# Altium project Control Logic.PrjPcb
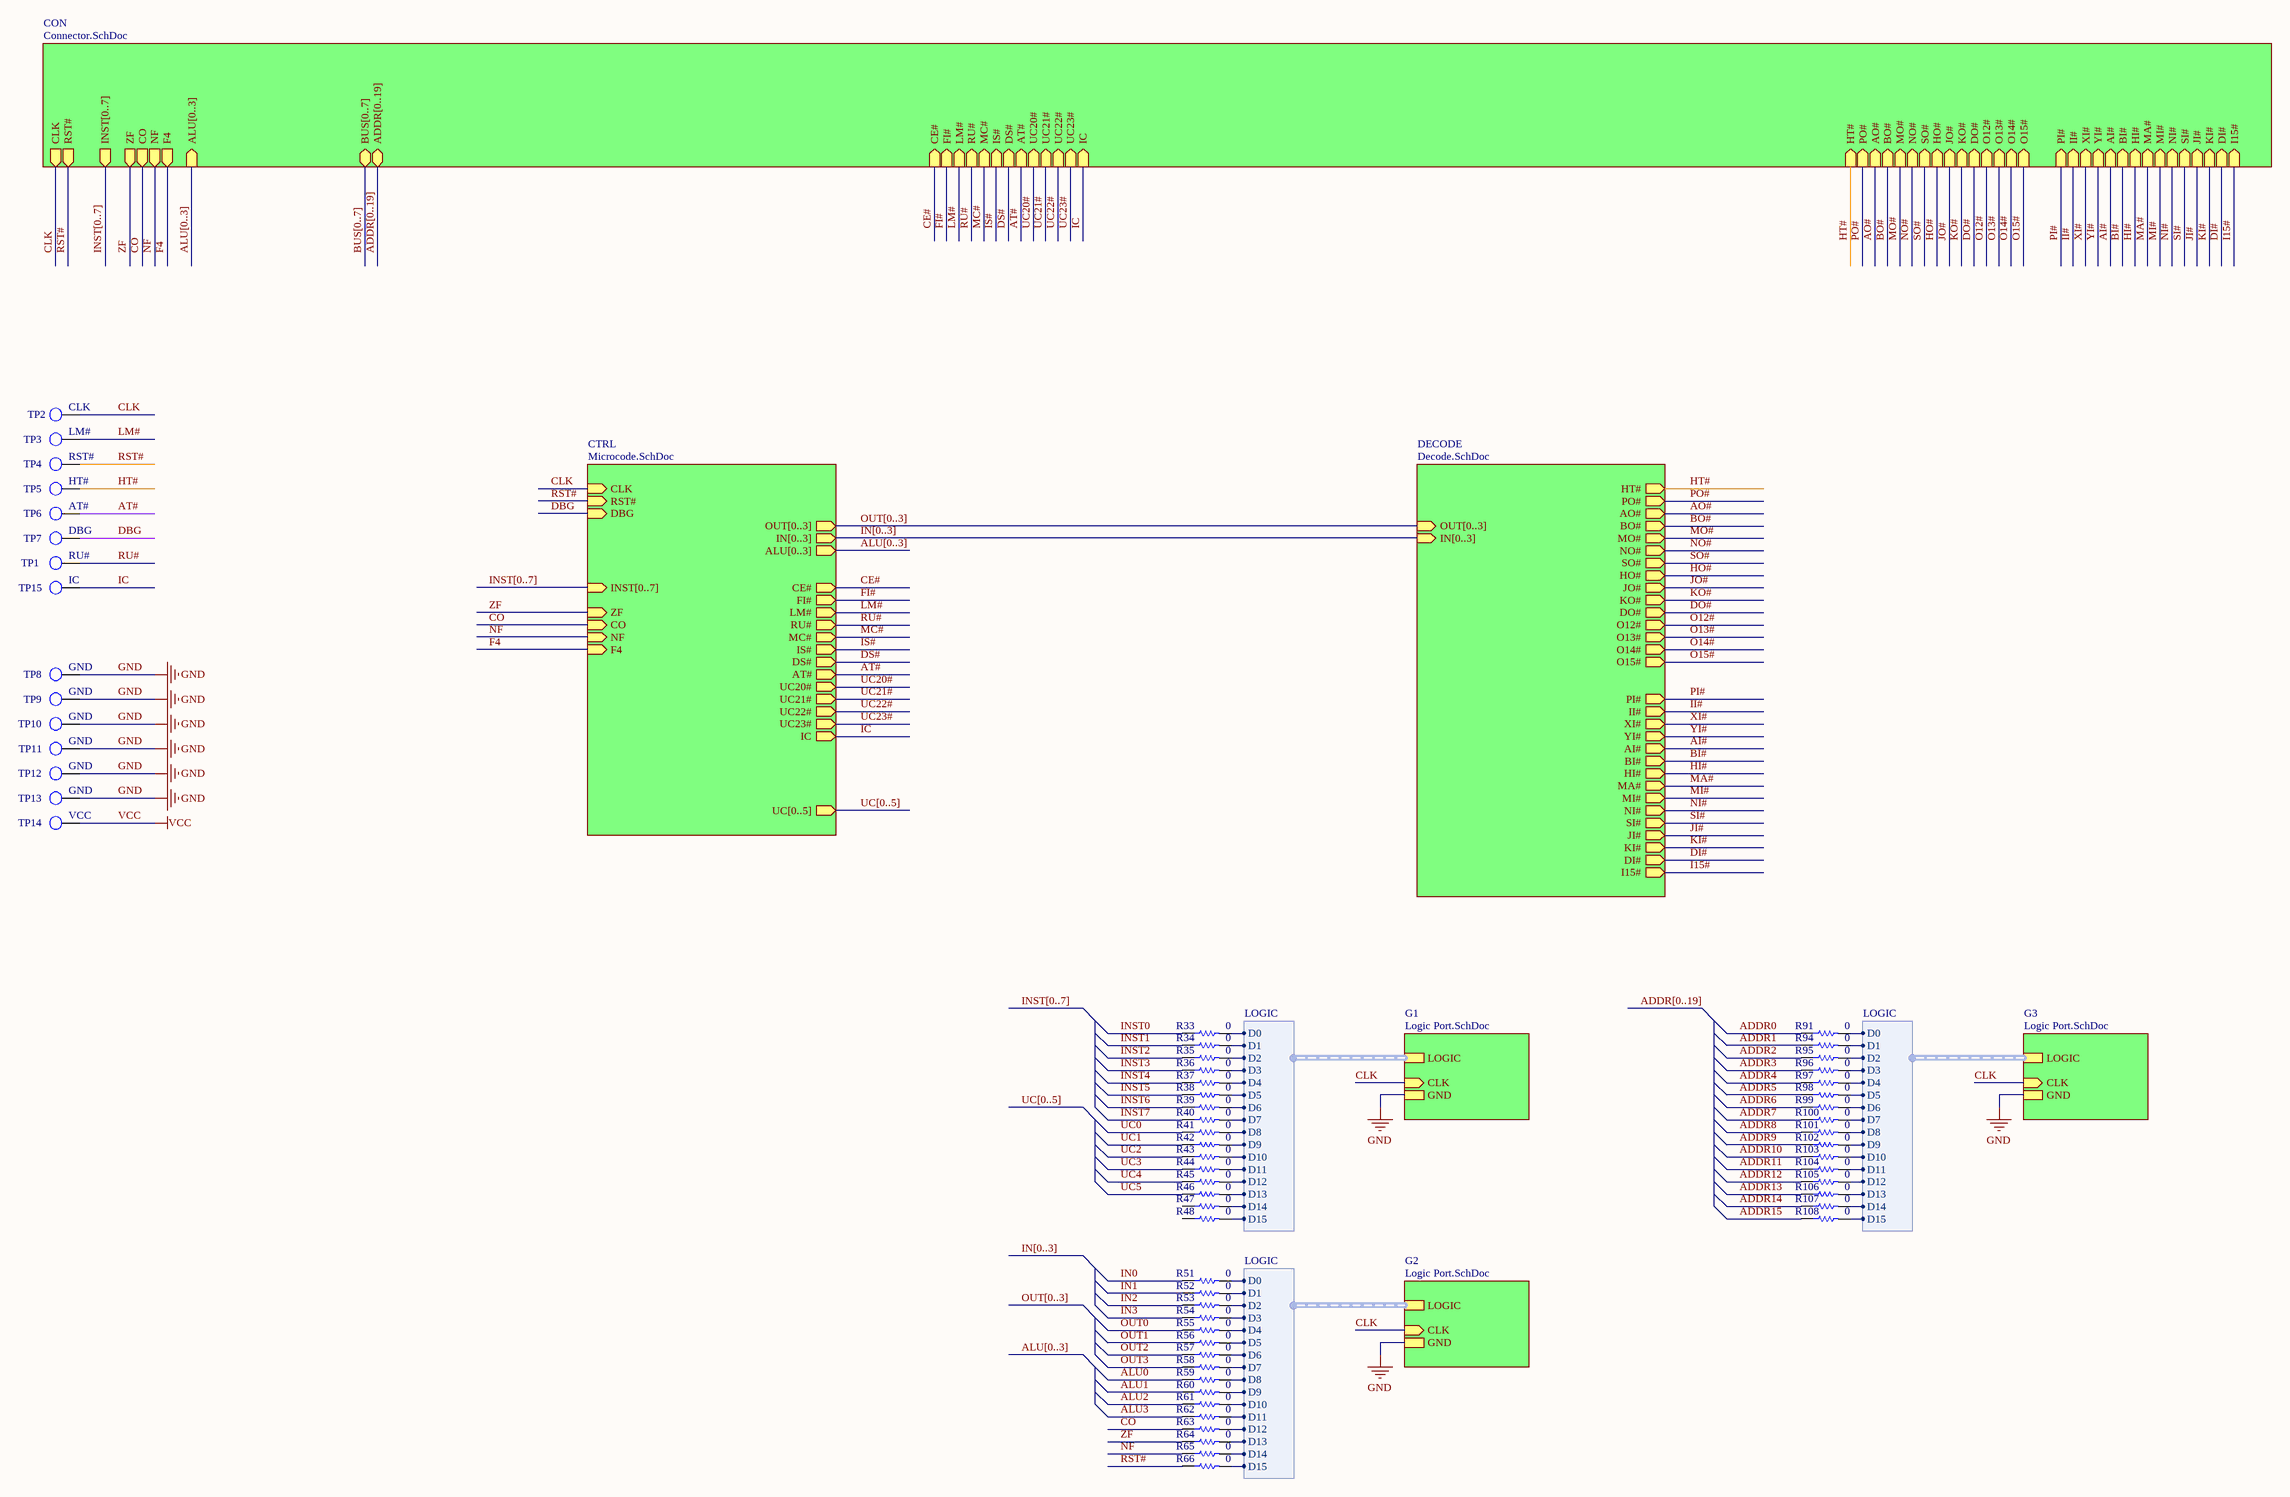
[diagram p0: Top.SchDoc]
6 sheets, 265 parts. Net scope: hierarchical (ports join the sheet entries above them; power ports are global).
Board file: Control Logic.PcbDoc
Sheets:
  Top.SchDoc
    CTRL = Microcode.SchDoc
    G1 = Logic Port.SchDoc
    DECODE = Decode.SchDoc
    G2 = Logic Port.SchDoc
    CON = Connector.SchDoc
    G3 = Logic Port.SchDoc
  Debugger.SchDoc

## Sheet Top.SchDoc
size C; Author: E. Sims; Organization: Let's Build Rockets Inc.; SheetNumber: 1; SheetTotal: 6

### Parts
R33  value 0  [AXIAL-0.3]  (hidden comment: Res1)
R34  value 0  [AXIAL-0.3]  (hidden comment: Res1)
R35  value 0  [AXIAL-0.3]  (hidden comment: Res1)
R36  value 0  [AXIAL-0.3]  (hidden comment: Res1)
R37  value 0  [AXIAL-0.3]  (hidden comment: Res1)
R38  value 0  [AXIAL-0.3]  (hidden comment: Res1)
R39  value 0  [AXIAL-0.3]  (hidden comment: Res1)
R40  value 0  [AXIAL-0.3]  (hidden comment: Res1)
R41  value 0  [AXIAL-0.3]  (hidden comment: Res1)
R42  value 0  [AXIAL-0.3]  (hidden comment: Res1)
R43  value 0  [AXIAL-0.3]  (hidden comment: Res1)
R44  value 0  [AXIAL-0.3]  (hidden comment: Res1)
R45  value 0  [AXIAL-0.3]  (hidden comment: Res1)
R46  value 0  [AXIAL-0.3]  (hidden comment: Res1)
R47  value 0  [AXIAL-0.3]  (hidden comment: Res1)
R48  value 0  [AXIAL-0.3]  (hidden comment: Res1)
R51  value 0  [AXIAL-0.3]  (hidden comment: Res1)
R52  value 0  [AXIAL-0.3]  (hidden comment: Res1)
R53  value 0  [AXIAL-0.3]  (hidden comment: Res1)
R54  value 0  [AXIAL-0.3]  (hidden comment: Res1)
R55  value 0  [AXIAL-0.3]  (hidden comment: Res1)
R56  value 0  [AXIAL-0.3]  (hidden comment: Res1)
R57  value 0  [AXIAL-0.3]  (hidden comment: Res1)
R58  value 0  [AXIAL-0.3]  (hidden comment: Res1)
R59  value 0  [AXIAL-0.3]  (hidden comment: Res1)
R60  value 0  [AXIAL-0.3]  (hidden comment: Res1)
R61  value 0  [AXIAL-0.3]  (hidden comment: Res1)
R62  value 0  [AXIAL-0.3]  (hidden comment: Res1)
R63  value 0  [AXIAL-0.3]  (hidden comment: Res1)
R64  value 0  [AXIAL-0.3]  (hidden comment: Res1)
R65  value 0  [AXIAL-0.3]  (hidden comment: Res1)
R66  value 0  [AXIAL-0.3]  (hidden comment: Res1)
R91  value 0  [AXIAL-0.3]  (hidden comment: Res1)
R94  value 0  [AXIAL-0.3]  (hidden comment: Res1)
R95  value 0  [AXIAL-0.3]  (hidden comment: Res1)
R96  value 0  [AXIAL-0.3]  (hidden comment: Res1)
R97  value 0  [AXIAL-0.3]  (hidden comment: Res1)
R98  value 0  [AXIAL-0.3]  (hidden comment: Res1)
R99  value 0  [AXIAL-0.3]  (hidden comment: Res1)
R100  value 0  [AXIAL-0.3]  (hidden comment: Res1)
R101  value 0  [AXIAL-0.3]  (hidden comment: Res1)
R102  value 0  [AXIAL-0.3]  (hidden comment: Res1)
R103  value 0  [AXIAL-0.3]  (hidden comment: Res1)
R104  value 0  [AXIAL-0.3]  (hidden comment: Res1)
R105  value 0  [AXIAL-0.3]  (hidden comment: Res1)
R106  value 0  [AXIAL-0.3]  (hidden comment: Res1)
R107  value 0  [AXIAL-0.3]  (hidden comment: Res1)
R108  value 0  [AXIAL-0.3]  (hidden comment: Res1)
TP1  RU#  [KSTN-5011_V]  (no BOM)
TP2  CLK  [KSTN-5011_V]  (no BOM)
TP3  LM#  [KSTN-5011_V]  (no BOM)
TP4  RST#  [KSTN-5011_V]  (no BOM)
TP5  HT#  [KSTN-5011_V]  (no BOM)
TP6  AT#  [KSTN-5011_V]  (no BOM)
TP7  DBG  [KSTN-5011_V]  (no BOM)
TP8  GND  [KSTN-5011_V]  (no BOM)
TP9  GND  [KSTN-5011_V]  (no BOM)
TP10  GND  [KSTN-5011_V]  (no BOM)
TP11  GND  [KSTN-5011_V]  (no BOM)
TP12  GND  [KSTN-5011_V]  (no BOM)
TP13  GND  [KSTN-5011_V]  (no BOM)
TP14  VCC  [KSTN-5011_V]  (no BOM)
TP15  IC  [KSTN-5011_V]  (no BOM)

### Sub-sheets
CON = Connector.SchDoc: NF (out), RST# (out), CLK (out), ZF (out), INST[0..7] (out), CO (out), F4 (out), IS# (in), UC21# (in), RU# (in), AT# (in), MC# (in), CE# (in), IC (in), UC22# (in), DS# (in), FI# (in), UC23# (in), UC20# (in), LM# (in), PO# (in), HT# (in), NO# (in), JO# (in), BO# (in), O14# (in), SO# (in), O15# (in), KO# (in), DO# (in), AO# (in), O12# (in), O13# (in), MO# (in), HO# (in), I15# (in), JI# (in), SI# (in), PI# (in), XI# (in), MI# (in), HI# (in), II# (in), DI# (in), NI# (in), BI# (in), MA# (in), YI# (in), KI# (in), AI# (in), BUS[0..7] (bidir), ALU[0..3] (in), ADDR[0..19] (bidir)
CTRL = Microcode.SchDoc: NF (in), RST# (in), CLK (in), ZF (in), INST[0..7] (in), CO (in), UC[0..5] (out), IN[0..3] (out), ALU[0..3] (out), OUT[0..3] (out), IS# (out), UC21# (out), RU# (out), AT# (out), MC# (out), CE# (out), IC (out), UC22# (out), DS# (out), FI# (out), UC23# (out), UC20# (out), LM# (out), F4 (in), DBG (in)
DECODE = Decode.SchDoc: IN[0..3] (in), OUT[0..3] (in), PO# (out), HT# (out), NO# (out), JO# (out), BO# (out), O14# (out), SO# (out), O15# (out), KO# (out), DO# (out), AO# (out), O12# (out), O13# (out), MO# (out), HO# (out), I15# (out), JI# (out), SI# (out), PI# (out), XI# (out), MI# (out), HI# (out), II# (out), DI# (out), NI# (out), BI# (out), MA# (out), YI# (out), KI# (out), AI# (out)
G1 = Logic Port.SchDoc: GND, CLK (in), LOGIC (harness LOGIC)
G2 = Logic Port.SchDoc: GND, CLK (in), LOGIC (harness LOGIC)
G3 = Logic Port.SchDoc: GND, CLK (in), LOGIC (harness LOGIC)

### Harnesses
LOGIC: D0, D1, D2, D3, D4, D5, D6, D7, D8, D9, D10, D11, D12, D13, D14, D15

### Nets
GND: TP8.1 TP9.1 TP10.1 TP11.1 TP12.1 TP13.1 ; sheet G1/GND, sheet G2/GND, sheet G3/GND
VCC: TP14.1
ADDR0: R91.1
ADDR1: R94.1
ADDR2: R95.1
ADDR3: R96.1
ADDR4: R97.1
ADDR5: R98.1
ADDR6: R99.1
ADDR7: R100.1
ADDR8: R101.1
ADDR9: R102.1
ADDR10: R103.1
ADDR11: R104.1
ADDR12: R105.1
ADDR13: R106.1
ADDR14: R107.1
ADDR15: R108.1
AI#: sheet DECODE/AI#, sheet CON/AI#
ALU0: R59.1
ALU1: R60.1
ALU2: R61.1
ALU3: R62.1
AO#: sheet DECODE/AO#, sheet CON/AO#
AT#: TP6.1 ; sheet CTRL/AT#, sheet CON/AT#
BI#: sheet DECODE/BI#, sheet CON/BI#
BO#: sheet DECODE/BO#, sheet CON/BO#
CE#: sheet CTRL/CE#, sheet CON/CE#
CLK: TP2.1 ; sheet CTRL/CLK, sheet G1/CLK, sheet G2/CLK, sheet CON/CLK, sheet G3/CLK
CO: R63.1 ; sheet CTRL/CO, sheet CON/CO
DBG: TP7.1 ; sheet CTRL/DBG
DI#: sheet DECODE/DI#, sheet CON/DI#
DO#: sheet DECODE/DO#, sheet CON/DO#
DS#: sheet CTRL/DS#, sheet CON/DS#
F4: sheet CTRL/F4, sheet CON/F4
FI#: sheet CTRL/FI#, sheet CON/FI#
HI#: sheet DECODE/HI#, sheet CON/HI#
HO#: sheet DECODE/HO#, sheet CON/HO#
HT#: TP5.1 ; sheet DECODE/HT#, sheet CON/HT#
I15#: sheet DECODE/I15#, sheet CON/I15#
IC: TP15.1 ; sheet CTRL/IC, sheet CON/IC
II#: sheet DECODE/II#, sheet CON/II#
IN0: R51.1
IN1: R52.1
IN2: R53.1
IN3: R54.1
INST0: R33.1
INST1: R34.1
INST2: R35.1
INST3: R36.1
INST4: R37.1
INST5: R38.1
INST6: R39.1
INST7: R40.1
IS#: sheet CTRL/IS#, sheet CON/IS#
JI#: sheet DECODE/JI#, sheet CON/JI#
JO#: sheet DECODE/JO#, sheet CON/JO#
KI#: sheet DECODE/KI#, sheet CON/KI#
KO#: sheet DECODE/KO#, sheet CON/KO#
LM#: TP3.1 ; sheet CTRL/LM#, sheet CON/LM#
LOGIC.D0: R33.2 ; sheet G1/LOGIC.D0
LOGIC.D0: R51.2 ; sheet G2/LOGIC.D0  [a separate net that carries the same name]
LOGIC.D0: R91.2 ; sheet G3/LOGIC.D0  [a separate net that carries the same name]
LOGIC.D1: R34.2 ; sheet G1/LOGIC.D1
LOGIC.D1: R52.2 ; sheet G2/LOGIC.D1  [a separate net that carries the same name]
LOGIC.D1: R94.2 ; sheet G3/LOGIC.D1  [a separate net that carries the same name]
LOGIC.D2: R35.2 ; sheet G1/LOGIC.D2
LOGIC.D2: R53.2 ; sheet G2/LOGIC.D2  [a separate net that carries the same name]
LOGIC.D2: R95.2 ; sheet G3/LOGIC.D2  [a separate net that carries the same name]
LOGIC.D3: R36.2 ; sheet G1/LOGIC.D3
LOGIC.D3: R54.2 ; sheet G2/LOGIC.D3  [a separate net that carries the same name]
LOGIC.D3: R96.2 ; sheet G3/LOGIC.D3  [a separate net that carries the same name]
LOGIC.D4: R37.2 ; sheet G1/LOGIC.D4
LOGIC.D4: R55.2 ; sheet G2/LOGIC.D4  [a separate net that carries the same name]
LOGIC.D4: R97.2 ; sheet G3/LOGIC.D4  [a separate net that carries the same name]
LOGIC.D5: R38.2 ; sheet G1/LOGIC.D5
LOGIC.D5: R56.2 ; sheet G2/LOGIC.D5  [a separate net that carries the same name]
LOGIC.D5: R98.2 ; sheet G3/LOGIC.D5  [a separate net that carries the same name]
LOGIC.D6: R39.2 ; sheet G1/LOGIC.D6
LOGIC.D6: R57.2 ; sheet G2/LOGIC.D6  [a separate net that carries the same name]
LOGIC.D6: R99.2 ; sheet G3/LOGIC.D6  [a separate net that carries the same name]
LOGIC.D7: R40.2 ; sheet G1/LOGIC.D7
LOGIC.D7: R58.2 ; sheet G2/LOGIC.D7  [a separate net that carries the same name]
LOGIC.D7: R100.2 ; sheet G3/LOGIC.D7  [a separate net that carries the same name]
LOGIC.D8: R41.2 ; sheet G1/LOGIC.D8
LOGIC.D8: R59.2 ; sheet G2/LOGIC.D8  [a separate net that carries the same name]
LOGIC.D8: R101.2 ; sheet G3/LOGIC.D8  [a separate net that carries the same name]
LOGIC.D9: R42.2 ; sheet G1/LOGIC.D9
LOGIC.D9: R60.2 ; sheet G2/LOGIC.D9  [a separate net that carries the same name]
LOGIC.D9: R102.2 ; sheet G3/LOGIC.D9  [a separate net that carries the same name]
LOGIC.D10: R43.2 ; sheet G1/LOGIC.D10
LOGIC.D10: R61.2 ; sheet G2/LOGIC.D10  [a separate net that carries the same name]
LOGIC.D10: R103.2 ; sheet G3/LOGIC.D10  [a separate net that carries the same name]
LOGIC.D11: R44.2 ; sheet G1/LOGIC.D11
LOGIC.D11: R62.2 ; sheet G2/LOGIC.D11  [a separate net that carries the same name]
LOGIC.D11: R104.2 ; sheet G3/LOGIC.D11  [a separate net that carries the same name]
LOGIC.D12: R45.2 ; sheet G1/LOGIC.D12
LOGIC.D12: R63.2 ; sheet G2/LOGIC.D12  [a separate net that carries the same name]
LOGIC.D12: R105.2 ; sheet G3/LOGIC.D12  [a separate net that carries the same name]
LOGIC.D13: R46.2 ; sheet G1/LOGIC.D13
LOGIC.D13: R64.2 ; sheet G2/LOGIC.D13  [a separate net that carries the same name]
LOGIC.D13: R106.2 ; sheet G3/LOGIC.D13  [a separate net that carries the same name]
LOGIC.D14: R47.2 ; sheet G1/LOGIC.D14
LOGIC.D14: R65.2 ; sheet G2/LOGIC.D14  [a separate net that carries the same name]
LOGIC.D14: R107.2 ; sheet G3/LOGIC.D14  [a separate net that carries the same name]
LOGIC.D15: R48.2 ; sheet G1/LOGIC.D15
LOGIC.D15: R66.2 ; sheet G2/LOGIC.D15  [a separate net that carries the same name]
LOGIC.D15: R108.2 ; sheet G3/LOGIC.D15  [a separate net that carries the same name]
MA#: sheet DECODE/MA#, sheet CON/MA#
MC#: sheet CTRL/MC#, sheet CON/MC#
MI#: sheet DECODE/MI#, sheet CON/MI#
MO#: sheet DECODE/MO#, sheet CON/MO#
NF: R65.1 ; sheet CTRL/NF, sheet CON/NF
NI#: sheet DECODE/NI#, sheet CON/NI#
NO#: sheet DECODE/NO#, sheet CON/NO#
O12#: sheet DECODE/O12#, sheet CON/O12#
O13#: sheet DECODE/O13#, sheet CON/O13#
O14#: sheet DECODE/O14#, sheet CON/O14#
O15#: sheet DECODE/O15#, sheet CON/O15#
OUT0: R55.1
OUT1: R56.1
OUT2: R57.1
OUT3: R58.1
PI#: sheet DECODE/PI#, sheet CON/PI#
PO#: sheet DECODE/PO#, sheet CON/PO#
RST#: R66.1 TP4.1 ; sheet CTRL/RST#, sheet CON/RST#
RU#: TP1.1 ; sheet CTRL/RU#, sheet CON/RU#
SI#: sheet DECODE/SI#, sheet CON/SI#
SO#: sheet DECODE/SO#, sheet CON/SO#
UC0: R41.1
UC1: R42.1
UC2: R43.1
UC3: R44.1
UC4: R45.1
UC5: R46.1
UC20#: sheet CTRL/UC20#, sheet CON/UC20#
UC21#: sheet CTRL/UC21#, sheet CON/UC21#
UC22#: sheet CTRL/UC22#, sheet CON/UC22#
UC23#: sheet CTRL/UC23#, sheet CON/UC23#
XI#: sheet DECODE/XI#, sheet CON/XI#
YI#: sheet DECODE/YI#, sheet CON/YI#
ZF: R64.1 ; sheet CTRL/ZF, sheet CON/ZF

Not connected (* = marked no-connect by the designer): R47 1; R48 1

### Buses and harness runs
bus ADDR[0..19]
bus ADDR[0..19] = sheet CON/ADDR[0..19]
bus ALU[0..3]
bus ALU[0..3] = sheet CON/ALU[0..3]
bus ALU[0..3] = sheet CTRL/ALU[0..3]
bus BUS[0..7] = sheet CON/BUS[0..7]
bus IN[0..3]
bus IN[0..3] = sheet CTRL/IN[0..3] = sheet DECODE/IN[0..3]
bus INST[0..7]
bus INST[0..7] = sheet CON/INST[0..7]
bus INST[0..7] = sheet CTRL/INST[0..7]
bus OUT[0..3]
bus OUT[0..3] = sheet CTRL/OUT[0..3] = sheet DECODE/OUT[0..3]
bus UC[0..5]
bus UC[0..5] = sheet CTRL/UC[0..5]

### Notes on the sheet
- Let's Build Rocket's Inc. Modular Paylaod System Based on TMP-010 Rev
  For more information visit https://github.com/LetsBuildRockets/Modular-Payload-System
  This work is licensed under CC BY-NC 4.0. To view a copy of this license, visit https://creativecommons.org/licenses/by-nc/4.0
- Title
- Size:
- Date:
- Assembly Variant:
- B
- Number:
- Time:
- Revision:
- Sheet
- of
- Author:
- File:

### Library data of the parts
R33-R48 R51-R66 R91 R94-R108 = Res1: Resistor; Published: 8-Jun-2000; LatestRevisionDate: 17-Jul-2002; LatestRevisionNote: Re-released for DXP Platform.; PackageReference: AXIAL-0.3; Publisher: Altium Limited; PackageDescription: Axial Device, Thru-Hole; 2 Leads; 0.3 in Pin Spacing
TP1-TP15 = TP

## Sheet Microcode.SchDoc
size B; Author: E. Sims; Organization: Let's Build Rockets Inc.; SheetNumber: 3; SheetTotal: 6; ENG_APP_DATE: --/--/--; DSN_APP_DATE: --/--/--; CHK_APP_DATE: --/--/--
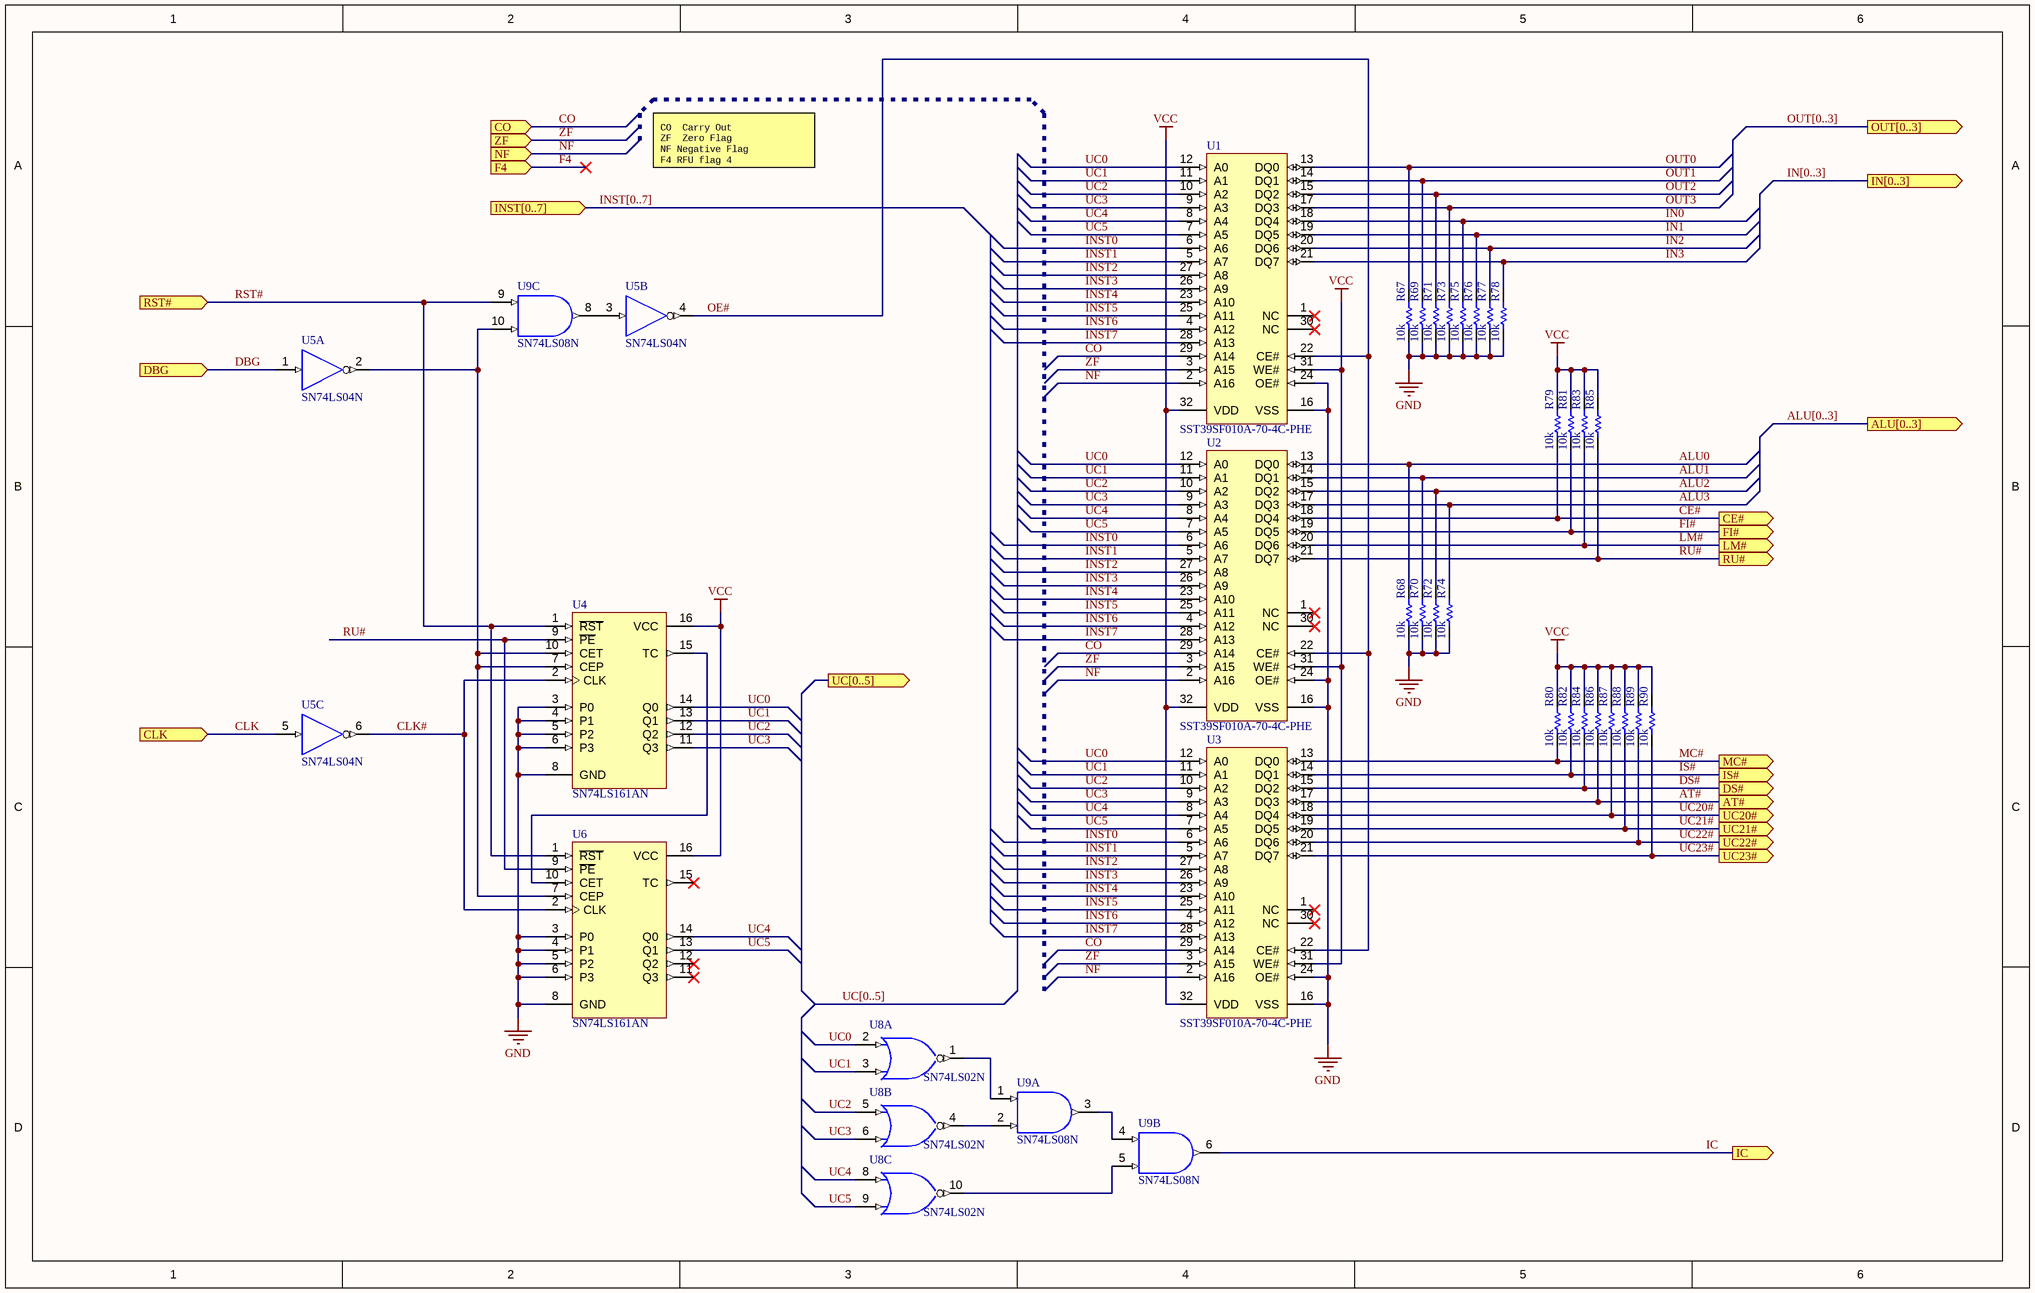
[diagram p1: Microcode.SchDoc]

### Parts
R67  value 10k  [AXIAL-0.3]  (hidden comment: Res1)
R68  value 10k  [AXIAL-0.3]  (hidden comment: Res1)
R69  value 10k  [AXIAL-0.3]  (hidden comment: Res1)
R70  value 10k  [AXIAL-0.3]  (hidden comment: Res1)
R71  value 10k  [AXIAL-0.3]  (hidden comment: Res1)
R72  value 10k  [AXIAL-0.3]  (hidden comment: Res1)
R73  value 10k  [AXIAL-0.3]  (hidden comment: Res1)
R74  value 10k  [AXIAL-0.3]  (hidden comment: Res1)
R75  value 10k  [AXIAL-0.3]  (hidden comment: Res1)
R76  value 10k  [AXIAL-0.3]  (hidden comment: Res1)
R77  value 10k  [AXIAL-0.3]  (hidden comment: Res1)
R78  value 10k  [AXIAL-0.3]  (hidden comment: Res1)
R79  value 10k  [AXIAL-0.3]  (hidden comment: Res1)
R80  value 10k  [AXIAL-0.3]  (hidden comment: Res1)
R81  value 10k  [AXIAL-0.3]  (hidden comment: Res1)
R82  value 10k  [AXIAL-0.3]  (hidden comment: Res1)
R83  value 10k  [AXIAL-0.3]  (hidden comment: Res1)
R84  value 10k  [AXIAL-0.3]  (hidden comment: Res1)
R85  value 10k  [AXIAL-0.3]  (hidden comment: Res1)
R86  value 10k  [AXIAL-0.3]  (hidden comment: Res1)
R87  value 10k  [AXIAL-0.3]  (hidden comment: Res1)
R88  value 10k  [AXIAL-0.3]  (hidden comment: Res1)
R89  value 10k  [AXIAL-0.3]  (hidden comment: Res1)
R90  value 10k  [AXIAL-0.3]  (hidden comment: Res1)
U1  SST39SF010A-70-4C-PHE  [MCHP-PDIP-PH32]
U2  SST39SF010A-70-4C-PHE  [MCHP-PDIP-PH32]
U3  SST39SF010A-70-4C-PHE  [MCHP-PDIP-PH32]
U4  SN74LS161AN  [N016]
U5  SN74LS04N  [N014]  (parts A,B,C of 6)
U6  SN74LS161AN  [N016]
U8  SN74LS02N  [N014]  (parts A,B,C of 4)
U9  SN74LS08N  [N014]  (parts A,B,C of 4)

### Ports
ALU[0..3] (out), AT# (out), CE# (out), CLK (in), CO (in), DBG (in), DS# (out), F4 (in), FI# (out), IC (out), IN[0..3] (out), INST[0..7] (in), IS# (out), LM# (out), MC# (out), NF (in), OUT[0..3] (out), RST# (in), RU# (out), UC20# (out), UC21# (out), UC22# (out), UC23# (out), UC[0..5] (out), ZF (in)

### Nets
GND: R67.1 R68.1 R69.1 R70.1 R71.1 R72.1 R73.1 R74.1 R75.1 R76.1 R77.1 R78.1 U1.16(VSS) U1.24(OE#) U2.16(VSS) U2.24(OE#) U3.16(VSS) U3.24(OE#) U4.3(P0) U4.4(P1) U4.5(P2) U4.6(P3) U4.8(GND) U5.7(GND) U6.3(P0) U6.4(P1) U6.5(P2) U6.6(P3) U6.8(GND) U8.7(GND) U9.7(GND)
VCC: R79.2 R80.2 R81.2 R82.2 R83.2 R84.2 R85.2 R86.2 R87.2 R88.2 R89.2 R90.2 U1.31(WE#) U1.32(VDD) U2.31(WE#) U2.32(VDD) U3.31(WE#) U3.32(VDD) U4.16(VCC) U5.14(VCC) U6.16(VCC) U8.14(VCC) U9.14(VCC)
ALU0: R68.2 U2.13(DQ0)
ALU1: R70.2 U2.14(DQ1)
ALU2: R72.2 U2.15(DQ2)
ALU3: R74.2 U2.17(DQ3)
AT#: R86.1 U3.17(DQ3) ; port AT#
CE#: R79.1 U2.18(DQ4) ; port CE#
CLK: U5.5(A) ; port CLK
CLK#: U4.2(CLK) U5.6(Y) U6.2(CLK)
CO: U1.29(A14) U2.29(A14) U3.29(A14) ; port CO
DBG: U5.1(A) ; port DBG
DS#: R84.1 U3.15(DQ2) ; port DS#
FI#: R81.1 U2.19(DQ5) ; port FI#
IC: U9.6(Y) ; port IC
IN0: R75.2 U1.18(DQ4)
IN1: R76.2 U1.19(DQ5)
IN2: R77.2 U1.20(DQ6)
IN3: R78.2 U1.21(DQ7)
INST0: U1.6(A6) U2.6(A6) U3.6(A6)
INST1: U1.5(A7) U2.5(A7) U3.5(A7)
INST2: U1.27(A8) U2.27(A8) U3.27(A8)
INST3: U1.26(A9) U2.26(A9) U3.26(A9)
INST4: U1.23(A10) U2.23(A10) U3.23(A10)
INST5: U1.25(A11) U2.25(A11) U3.25(A11)
INST6: U1.4(A12) U2.4(A12) U3.4(A12)
INST7: U1.28(A13) U2.28(A13) U3.28(A13)
IS#: R82.1 U3.14(DQ1) ; port IS#
LM#: R83.1 U2.20(DQ6) ; port LM#
MC#: R80.1 U3.13(DQ0) ; port MC#
NF: U1.2(A16) U2.2(A16) U3.2(A16) ; port NF
OE#: U1.22(CE#) U2.22(CE#) U3.22(CE#) U5.4(Y)
OUT0: R67.2 U1.13(DQ0)
OUT1: R69.2 U1.14(DQ1)
OUT2: R71.2 U1.15(DQ2)
OUT3: R73.2 U1.17(DQ3)
RST#: U4.1(~{RST}) U6.1(~{RST}) U9.9(A) ; port RST#
RU#: R85.1 U2.21(DQ7) U4.9(~{PE}) U6.9(~{PE}) ; port RU#
UC0: U1.12(A0) U2.12(A0) U3.12(A0) U4.14(Q0) U8.2(A)
UC1: U1.11(A1) U2.11(A1) U3.11(A1) U4.13(Q1) U8.3(B)
UC2: U1.10(A2) U2.10(A2) U3.10(A2) U4.12(Q2) U8.5(A)
UC3: U1.9(A3) U2.9(A3) U3.9(A3) U4.11(Q3) U8.6(B)
UC4: U1.8(A4) U2.8(A4) U3.8(A4) U6.14(Q0) U8.8(A)
UC5: U1.7(A5) U2.7(A5) U3.7(A5) U6.13(Q1) U8.9(B)
UC20#: R87.1 U3.18(DQ4) ; port UC20#
UC21#: R88.1 U3.19(DQ5) ; port UC21#
UC22#: R89.1 U3.20(DQ6) ; port UC22#
UC23#: R90.1 U3.21(DQ7) ; port UC23#
ZF: U1.3(A15) U2.3(A15) U3.3(A15) ; port ZF
NetU4_7: U4.7(CEP) U4.10(CET) U5.2(Y) U6.7(CEP) U9.10(B)
NetU4_15: U4.15(TC) U6.10(CET)
NetU5_3: U5.3(A) U9.8(Y)
NetU8_1: U8.1(Y) U9.1(A)
NetU8_4: U8.4(Y) U9.2(B)
NetU8_10: U8.10(Y) U9.5(B)
NetU9_3: U9.3(Y) U9.4(A)

Not connected (* = marked no-connect by the designer): U1 1(NC)* 30(NC)*; U2 1(NC)* 30(NC)*; U3 1(NC)* 30(NC)*; U6 11(Q3)* 12(Q2)* 15(TC)*

### Buses and harness runs
bus ALU[0..3] = port ALU[0..3]
bus IN[0..3] = port IN[0..3]
bus INST[0..7] = port INST[0..7]
bus OUT[0..3] = port OUT[0..3]
bus UC[0..5] = port UC[0..5]

### Notes on the sheet
- CO  Carry Out
  ZF  Zero Flag
  NF Negative Flag
  F4 RFU flag 4
- DWG NO:
- REV:
- THIS DOCUMENT AND THE DATA DISCLOSED HEREIN OR
- HEREWITH IS THE PROPERTY OF ALTIUM LIMITED AND MAY
- BE FREELY DISTRIBUTED IN WHOLE. NO RIGHTS ARE
- RESERVED OR EXPRESS OR IMPLIED WARANTEE GIVEN.
- REVISION
- DESCRIPTION
- DATE
- APPROVED
- ENG:
- APPROVALS
- PROJECT
- DSN:
- CHK:
- REFERENCE DOCUMENTS
- PROJECT REVISION:
- TITLE
- DOCUMENT REVISION:
- DESIGN ITEM:
- BOM:
- FAB DWG:
- PCB DWG:
- ASSY DWG:
- SCALE:
- A2
- SIZE
- CAGE CODE
- FILE NAME
- DWG NO.
- SHEET
- OF
- REV

### Library data of the parts
R67-R90 = Res1: Resistor; Published: 8-Jun-2000; LatestRevisionDate: 17-Jul-2002; LatestRevisionNote: Re-released for DXP Platform.; PackageReference: AXIAL-0.3; Publisher: Altium Limited; PackageDescription: Axial Device, Thru-Hole; 2 Leads; 0.3 in Pin Spacing
U1-U3 = CMP-0378-00001-1: 1 Mbit Multi-Purpose Flash, 4.5 to 5.5 V, 1 kHz, 0 to 70 degC, 32-pin PDIP (PH32), Tube; Manufacturer: Microchip; ComponentLink3Description: Package Specification; ComponentLink1URL: http://www.microchip.com; ComponentLink2Description: Datasheet; PackageReference: PDIP-PH32; ComponentLink2URL: http://ww1.microchip.com/downloads/en/DeviceDoc/25022A.pdf; DatasheetVersion: Rev. A; ComponentLink3URL: http://ww1.microchip.com/downloads/en/DeviceDoc/25022A.pdf; ComponentLink4Description: Product URL; ComponentLink1Description: Manufacturer URL; PartNumber: SST39SF010A-70-4C-PHE; ComponentLink4URL: http://www.microchip.com/SST39SF010A; PackageDescription: 32-Pin Plastic Dual In-line Pins, Row Spacing 15.24 mm, 41.91 x 13.72 mm Body, 2.54 mm Pitch; Code_JEDEC: MO-015; Mounting Technology: Through Hole; PackageVersion: Rev. A
U4 U6 = SN74LS161AN: Synchronous 4-Bit Counter; Published: 8-Jun-2000; LatestRevisionDate: 04-Mar-2005; LatestRevisionNote: Stylized 3D Model Added.; DatasheetVersion: Mar-1988; PackageVersion: Oct-1995; PackageReference: N016; Publisher: Altium Limited; PackageDescription: DIP; 16 Leads; Row Spacing 7.62 mm; Pitch 2.54 mm; Code_JEDEC: MS-001-BB; ComponentLink1Description: Manufacturer Link; ComponentLink1URL: http://www.ti.com/; ComponentLink2Description: Datasheet; ComponentLink2URL: http://www-s.ti.com/sc/ds/sn74ls161a.pdf; ComponentLink3Description: URL Link1; ComponentLink3URL: http://focus.ti.com/docs/prod/folders/print/sn74ls161a.html
U5 = SN74LS04N: Hex Inverter; Published: 8-Jun-2000; LatestRevisionDate: 04-Mar-2005; LatestRevisionNote: Stylized 3D Model Added.; DatasheetVersion: Mar-1988; PackageVersion: Oct-1995; PackageReference: N014; Publisher: Altium Limited; PackageDescription: DIP; 14 Leads; Row Spacing 7.62 mm; Pitch 2.54 mm; ComponentLink1Description: Manufacturer Link; ComponentLink1URL: http://www.ti.com/; ComponentLink2Description: Datasheet; ComponentLink2URL: http://www-s.ti.com/sc/ds/sn74ls04.pdf
U8 = SN74LS02N: Quadruple 2-Input Positive-NOR Gate; Published: 8-Jun-2000; LatestRevisionDate: 04-Mar-2005; LatestRevisionNote: Stylized 3D Model Added.; DatasheetVersion: Mar-1988; PackageVersion: Oct-1995; PackageReference: N014; Publisher: Altium Limited; PackageDescription: DIP; 14 Leads; Row Spacing 7.62 mm; Pitch 2.54 mm; ComponentLink1Description: Manufacturer Link; ComponentLink1URL: http://www.ti.com/; ComponentLink2Description: Datasheet; ComponentLink2URL: http://www-s.ti.com/sc/ds/sn54s02.pdf
U9 = SN74LS08N: Quadruple 2-Input Positive-AND Gate; Published: 8-Jun-2000; LatestRevisionDate: 04-Mar-2005; LatestRevisionNote: Stylized 3D Model Added.; DatasheetVersion: Mar-1988; PackageVersion: Oct-1995; PackageReference: N014; Publisher: Altium Limited; PackageDescription: DIP; 14 Leads; Row Spacing 7.62 mm; Pitch 2.54 mm; ComponentLink1Description: Manufacturer Link; ComponentLink1URL: http://www.ti.com/; ComponentLink2Description: Datasheet; ComponentLink2URL: http://www-s.ti.com/sc/ds/SN74LS08.pdf

## Sheet Logic Port.SchDoc
size B; Author: E. Sims; Organization: Let's Build Rockets Inc.; SheetNumber: 5; SheetTotal: 6
Used 3 times, as channels G1, G2, G3. Parts and nets are listed once, with the designators drawn on the sheet.
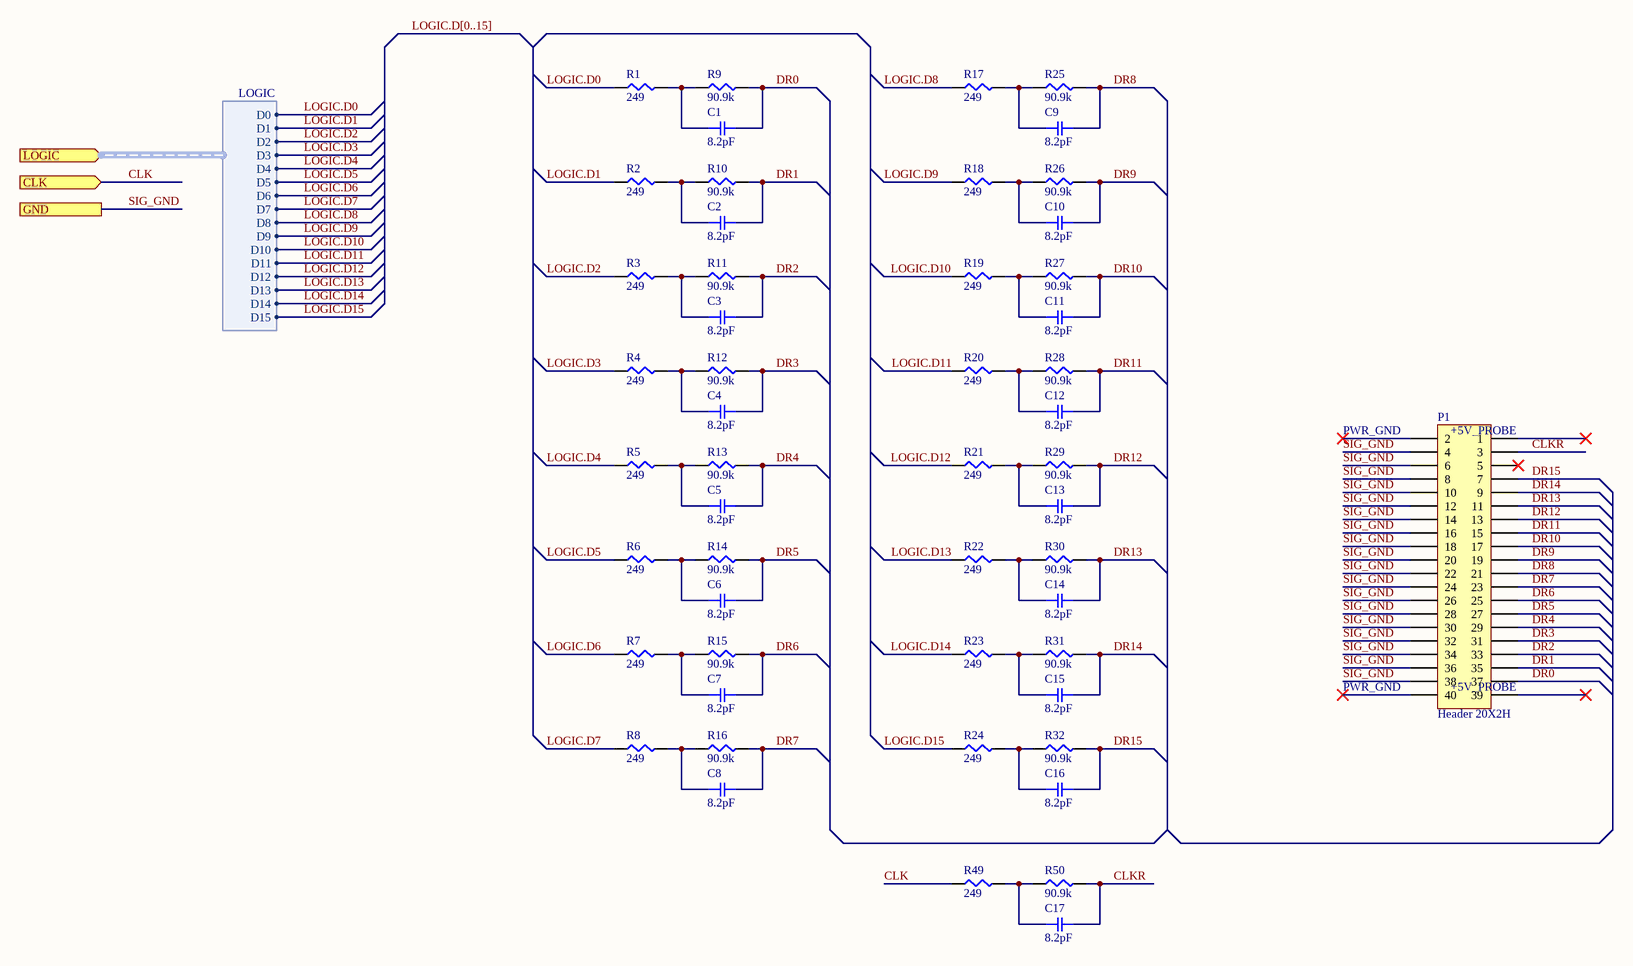
[diagram p2: Logic Port.SchDoc]

### Parts
C1  8.2pF  [SMD-0603C]
C2  8.2pF  [SMD-0603C]
C3  8.2pF  [SMD-0603C]
C4  8.2pF  [SMD-0603C]
C5  8.2pF  [SMD-0603C]
C6  8.2pF  [SMD-0603C]
C7  8.2pF  [SMD-0603C]
C8  8.2pF  [SMD-0603C]
C9  8.2pF  [SMD-0603C]
C10  8.2pF  [SMD-0603C]
C11  8.2pF  [SMD-0603C]
C12  8.2pF  [SMD-0603C]
C13  8.2pF  [SMD-0603C]
C14  8.2pF  [SMD-0603C]
C15  8.2pF  [SMD-0603C]
C16  8.2pF  [SMD-0603C]
C17  8.2pF  [SMD-0603C]
P1  Header 20X2H  [HDR2X20H]
R1  249  [SMD-0603-RES]
R2  249  [SMD-0603-RES]
R3  249  [SMD-0603-RES]
R4  249  [SMD-0603-RES]
R5  249  [SMD-0603-RES]
R6  249  [SMD-0603-RES]
R7  249  [SMD-0603-RES]
R8  249  [SMD-0603-RES]
R9  value 90.9k  [SMD-0603-RES]
R10  90.9k  [SMD-0603-RES]
R11  90.9k  [SMD-0603-RES]
R12  90.9k  [SMD-0603-RES]
R13  90.9k  [SMD-0603-RES]
R14  90.9k  [SMD-0603-RES]
R15  90.9k  [SMD-0603-RES]
R16  90.9k  [SMD-0603-RES]
R17  249  [SMD-0603-RES]
R18  249  [SMD-0603-RES]
R19  249  [SMD-0603-RES]
R20  249  [SMD-0603-RES]
R21  249  [SMD-0603-RES]
R22  249  [SMD-0603-RES]
R23  249  [SMD-0603-RES]
R24  249  [SMD-0603-RES]
R25  90.9k  [SMD-0603-RES]
R26  90.9k  [SMD-0603-RES]
R27  90.9k  [SMD-0603-RES]
R28  90.9k  [SMD-0603-RES]
R29  90.9k  [SMD-0603-RES]
R30  90.9k  [SMD-0603-RES]
R31  90.9k  [SMD-0603-RES]
R32  90.9k  [SMD-0603-RES]
R49  249  [SMD-0603-RES]
R50  90.9k  [SMD-0603-RES]

### Ports
CLK (in), GND, LOGIC (in, harness LOGIC)

### Harnesses
LOGIC: D0, D1, D2, D3, D4, D5, D6, D7, D8, D9, D10, D11, D12, D13, D14, D15

### Nets
CLK: R49.1 ; port CLK
CLKR: C17.2 P1.3 R50.2
DR0: C1.2 P1.37 R9.2
DR1: C2.2 P1.35 R10.2
DR2: C3.2 P1.33 R11.2
DR3: C4.2 P1.31 R12.2
DR4: C5.2 P1.29 R13.2
DR5: C6.2 P1.27 R14.2
DR6: C7.2 P1.25 R15.2
DR7: C8.2 P1.23 R16.2
DR8: C9.2 P1.21 R25.2
DR9: C10.2 P1.19 R26.2
DR10: C11.2 P1.17 R27.2
DR11: C12.2 P1.15 R28.2
DR12: C13.2 P1.13 R29.2
DR13: C14.2 P1.11 R30.2
DR14: C15.2 P1.9 R31.2
DR15: C16.2 P1.7 R32.2
LOGIC.D0: R1.1 ; port LOGIC.D0
LOGIC.D1: R2.1 ; port LOGIC.D1
LOGIC.D2: R3.1 ; port LOGIC.D2
LOGIC.D3: R4.1 ; port LOGIC.D3
LOGIC.D4: R5.1 ; port LOGIC.D4
LOGIC.D5: R6.1 ; port LOGIC.D5
LOGIC.D6: R7.1 ; port LOGIC.D6
LOGIC.D7: R8.1 ; port LOGIC.D7
LOGIC.D8: R17.1 ; port LOGIC.D8
LOGIC.D9: R18.1 ; port LOGIC.D9
LOGIC.D10: R19.1 ; port LOGIC.D10
LOGIC.D11: R20.1 ; port LOGIC.D11
LOGIC.D12: R21.1 ; port LOGIC.D12
LOGIC.D13: R22.1 ; port LOGIC.D13
LOGIC.D14: R23.1 ; port LOGIC.D14
LOGIC.D15: R24.1 ; port LOGIC.D15
SIG_GND: P1.4 P1.6 P1.8 P1.10 P1.12 P1.14 P1.16 P1.18 P1.20 P1.22 P1.24 P1.26 P1.28 P1.30 P1.32 P1.34 P1.36 P1.38 ; port GND
NetC1_1: C1.1 R1.2 R9.1
NetC2_1: C2.1 R2.2 R10.1
NetC3_1: C3.1 R3.2 R11.1
NetC4_1: C4.1 R4.2 R12.1
NetC5_1: C5.1 R5.2 R13.1
NetC6_1: C6.1 R6.2 R14.1
NetC7_1: C7.1 R7.2 R15.1
NetC8_1: C8.1 R8.2 R16.1
NetC9_1: C9.1 R17.2 R25.1
NetC10_1: C10.1 R18.2 R26.1
NetC11_1: C11.1 R19.2 R27.1
NetC12_1: C12.1 R20.2 R28.1
NetC13_1: C13.1 R21.2 R29.1
NetC14_1: C14.1 R22.2 R30.1
NetC15_1: C15.1 R23.2 R31.1
NetC16_1: C16.1 R24.2 R32.1
NetC17_1: C17.1 R49.2 R50.1

Not connected (* = marked no-connect by the designer): P1 1* 2* 5* 39* 40*

### Channels
G1: designators end in _G1; ports CLK=CLK GND=GND
G2: designators end in _G2; ports CLK=CLK GND=GND
G3: designators end in _G3; ports CLK=CLK GND=GND

### Buses and harness runs
bus LOGIC.D[0..15]

### Notes on the sheet
- (near P1) PWR_GND
- (near P1) +5V_PROBE
- Let's Build Rocket's Inc. Modular Paylaod System Based on TMP-010 Rev
  For more information visit https://github.com/LetsBuildRockets/Modular-Payload-System
  This work is licensed under CC BY-NC 4.0. To view a copy of this license, visit https://creativecommons.org/licenses/by-nc/4.0
- Title
- Size:
- Date:
- Assembly Variant:
- B
- Number:
- Time:
- Revision:
- Sheet
- of
- Author:
- File:

### Library data of the parts
C1-C17 = GRM1885C1H8R2BA01D: CAP CER 8.2PF 50V NP0 0603; Manufacturer: Murata Electronics North America; Factory Stock: 0; Unit Price (USD): 0.11; Minimum Quantity: 1; Tolerance: ±0.1pF; Temperature Coefficient: C0G, NP0; Datasheets: http://www.murata.com/~/media/webrenewal/support/library/catalog/products/capacitor/mlcc/c02e.pdf; Image: //media.digikey.com/Renders/Murata%20Renders/ZRB-SERIES-0402.jpg; Digi-Key Part Number: 490-12727-1-ND; Part Number: GRM1885C1H8R2BA01D; Quantity Available: 816; @ qty: 0; Packaging: Cut Tape (CT); Series: GRM; Part Status: Active; Value: 8.2pF; Voltage: 50V; Operating Temperature: -55°C ~ 125°C; Features: -; Ratings: -; Applications: General Purpose; Mounting Type: Surface Mount, MLCC; Package / Case: 0603 (1608 Metric); Size / Dimension: 0.063" L x 0.031" W (1.60mm x 0.80mm); Height - Seated (Max): -; Thickness (Max): 0.035" (0.90mm); Lead Spacing: -; Lead Style: -
P1 = Header 20X2H: Header, 20-Pin, Dual row, Right Angle; LatestRevisionDate: 17-Jul-2002; LatestRevisionNote: Re-released for DXP Platform.; Publisher: Altium Limited
R1-R8 R17-R24 R49 = ERJ-3EKF2490V: RES SMD 249 OHM 1% 1/10W 0603; Manufacturer: Panasonic Electronic Components; Factory Stock: 0; Unit Price (USD): 0.00379; @ qty: 1500; Minimum Quantity: 1; Power (Watts): 0.1W, 1/10W; Temperature Coefficient: ±100ppm/°C; Value: 249; Part Number: ERJ-3EKF2490V; Datasheets: http://industrial.panasonic.com/www-cgi/jvcr13pz.cgi?E+PZ+3+AOA0002+ERJ3EKF2490V+7+WW; Image: //media.digikey.com/Photos/Panasonic%20Photos/MFG_ERJ-P6W%20Series.jpg; Digi-Key Part Number: P249HCT-ND; Quantity Available: 112432; Packaging: Cut Tape (CT); Series: ERJ; Part Status: Active; Tolerance: ±1%; Composition: Thick Film; Features: Automotive AEC-Q200; Operating Temperature: -55°C ~ 155°C; Package / Case: 0603 (1608 Metric); Supplier Device Package: 0603; Size / Dimension: 0.063" L x 0.031" W (1.60mm x 0.80mm); Height - Seated (Max): 0.022" (0.55mm); Number of Terminations: 2; Failure Rate: -
R9-R16 R25-R32 R50 = ERJ-3EKF9092V: RES SMD 90.9K OHM 1% 1/10W 0603; Manufacturer: Panasonic Electronic Components; Factory Stock: 0; Unit Price (USD): 0.00379; @ qty: 1500; Minimum Quantity: 1; Power (Watts): 0.1W, 1/10W; Temperature Coefficient: ±100ppm/°C; Part Number: ERJ-3EKF9092V; Datasheets: http://industrial.panasonic.com/www-cgi/jvcr13pz.cgi?E+PZ+3+AOA0002+ERJ3EKF9092V+7+WW; Image: //media.digikey.com/Photos/Panasonic%20Photos/MFG_ERJ-P6W%20Series.jpg; Digi-Key Part Number: P90.9KHCT-ND; Quantity Available: 254781; Packaging: Cut Tape (CT); Series: ERJ; Part Status: Active; Tolerance: ±1%; Composition: Thick Film; Features: Automotive AEC-Q200; Operating Temperature: -55°C ~ 155°C; Package / Case: 0603 (1608 Metric); Supplier Device Package: 0603; Size / Dimension: 0.063" L x 0.031" W (1.60mm x 0.80mm); Height - Seated (Max): 0.022" (0.55mm); Number of Terminations: 2; Failure Rate: -
  R10-R16 R25-R32 R50: Value: 90.9k

## Sheet Decode.SchDoc
size B; Author: E. Sims; Organization: Let's Build Rockets Inc.; SheetNumber: 4; SheetTotal: 6
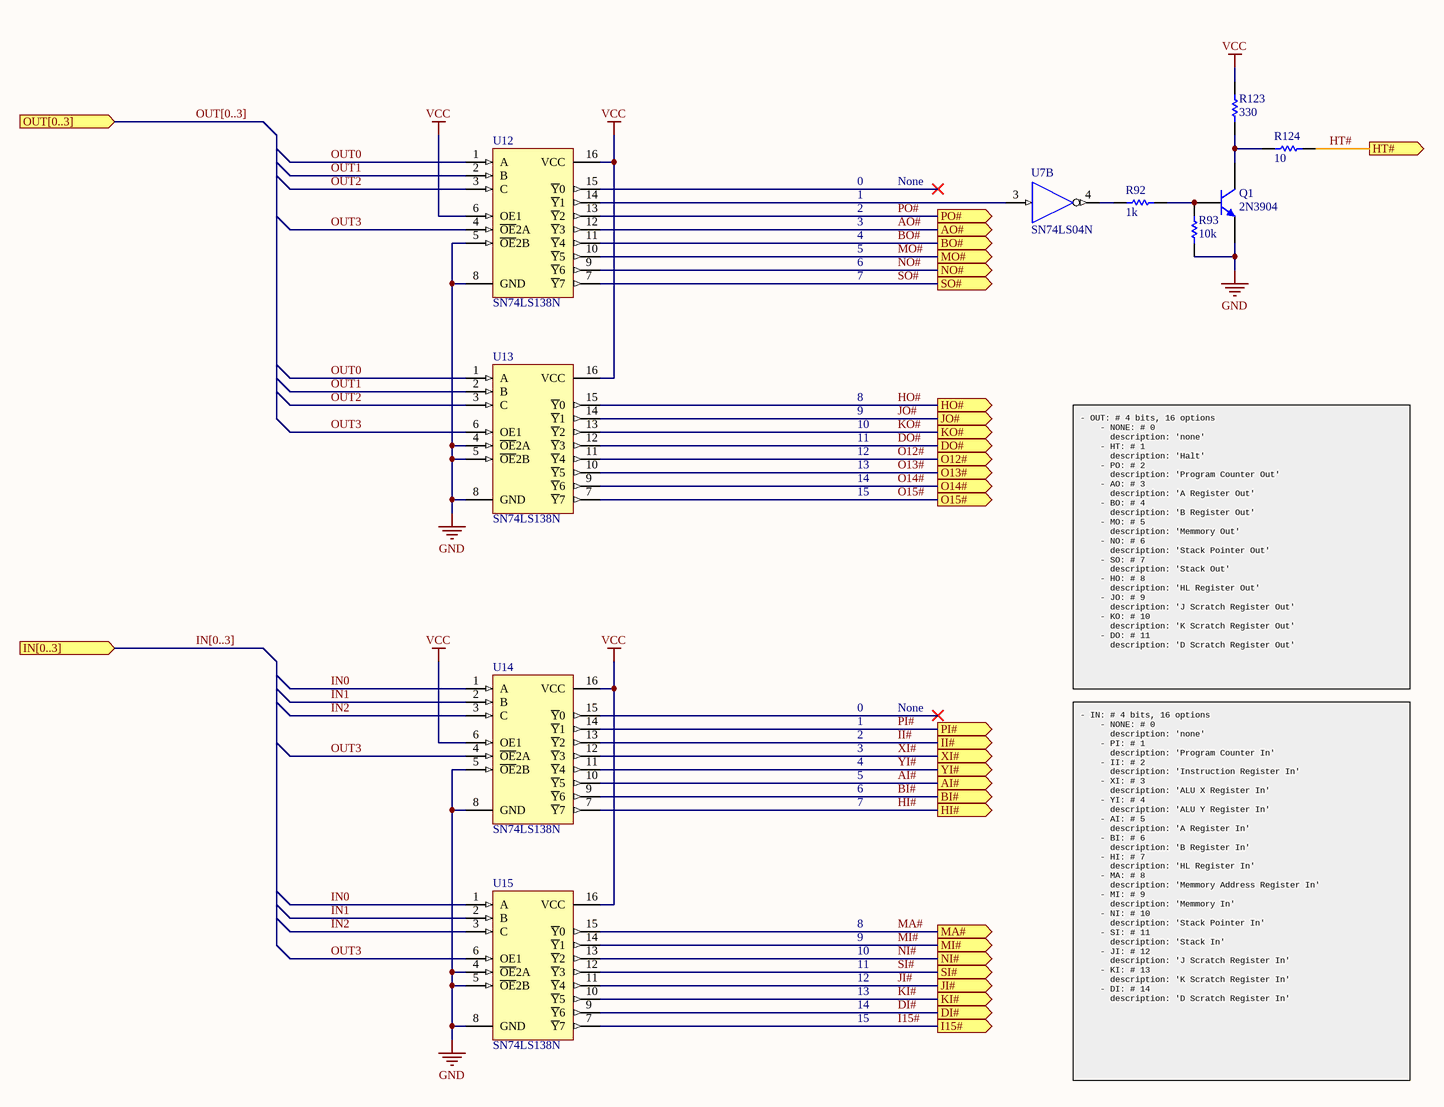
[diagram p3: Decode.SchDoc]

### Parts
Q1  2N3904  [TO-92A]
R92  value 1k  [AXIAL-0.3]  (hidden comment: Res1)
R93  value 10k  [AXIAL-0.3]  (hidden comment: Res1)
R123  value 330  [AXIAL-0.3]  (hidden comment: Res1)
R124  value 10  [AXIAL-0.3]  (hidden comment: Res1)
U7  SN74LS04N  [N014]  (part B of 6)
U12  SN74LS138N  [N016]
U13  SN74LS138N  [N016]
U14  SN74LS138N  [N016]
U15  SN74LS138N  [N016]

### Ports
AI# (out), AO# (out), BI# (out), BO# (out), DI# (out), DO# (out), HI# (out), HO# (out), HT# (out), I15# (out), II# (out), IN[0..3] (in), JI# (out), JO# (out), KI# (out), KO# (out), MA# (out), MI# (out), MO# (out), NI# (out), NO# (out), O12# (out), O13# (out), O14# (out), O15# (out), OUT[0..3] (in), PI# (out), PO# (out), SI# (out), SO# (out), XI# (out), YI# (out)

### Nets
GND: Q1.1(E) R93.2 U7.7(GND) U12.5(~{OE}2B) U12.8(GND) U13.4(~{OE}2A) U13.5(~{OE}2B) U13.8(GND) U14.5(~{OE}2B) U14.8(GND) U15.4(~{OE}2A) U15.5(~{OE}2B) U15.8(GND)
VCC: R123.1 U7.14(VCC) U12.6(OE1) U12.16(VCC) U13.16(VCC) U14.6(OE1) U14.16(VCC) U15.16(VCC)
AI#: U14.10(~{Y}5) ; port AI#
AO#: U12.12(~{Y}3) ; port AO#
BI#: U14.9(~{Y}6) ; port BI#
BO#: U12.11(~{Y}4) ; port BO#
DI#: U15.9(~{Y}6) ; port DI#
DO#: U13.12(~{Y}3) ; port DO#
HI#: U14.7(~{Y}7) ; port HI#
HO#: U13.15(~{Y}0) ; port HO#
HT#: R124.1 ; port HT#
I15#: U15.7(~{Y}7) ; port I15#
II#: U14.13(~{Y}2) ; port II#
IN0: U14.1(A) U15.1(A)
IN1: U14.2(B) U15.2(B)
IN2: U14.3(C) U15.3(C)
JI#: U15.11(~{Y}4) ; port JI#
JO#: U13.14(~{Y}1) ; port JO#
KI#: U15.10(~{Y}5) ; port KI#
KO#: U13.13(~{Y}2) ; port KO#
MA#: U15.15(~{Y}0) ; port MA#
MI#: U15.14(~{Y}1) ; port MI#
MO#: U12.10(~{Y}5) ; port MO#
NI#: U15.13(~{Y}2) ; port NI#
NO#: U12.9(~{Y}6) ; port NO#
O12#: U13.11(~{Y}4) ; port O12#
O13#: U13.10(~{Y}5) ; port O13#
O14#: U13.9(~{Y}6) ; port O14#
O15#: U13.7(~{Y}7) ; port O15#
OUT0: U12.1(A) U13.1(A)
OUT1: U12.2(B) U13.2(B)
OUT2: U12.3(C) U13.3(C)
OUT3: U12.4(~{OE}2A) U13.6(OE1) U14.4(~{OE}2A) U15.6(OE1)
PI#: U14.14(~{Y}1) ; port PI#
PO#: U12.13(~{Y}2) ; port PO#
SI#: U15.12(~{Y}3) ; port SI#
SO#: U12.7(~{Y}7) ; port SO#
XI#: U14.12(~{Y}3) ; port XI#
YI#: U14.11(~{Y}4) ; port YI#
NetQ1_2: Q1.2(B) R92.1 R93.1
NetQ1_3: Q1.3(C) R123.2 R124.2
NetR92_2: R92.2 U7.4(Y)
NetU7_3: U7.3(A) U12.14(~{Y}1)

Not connected (* = marked no-connect by the designer): U12 15(~{Y}0)*; U14 15(~{Y}0)*

### Buses and harness runs
bus IN[0..3] = port IN[0..3]
bus OUT[0..3] = port OUT[0..3]

### Notes on the sheet
- 0
- 1
- 2
- None
- 3
- 4
- 5
- 6
- 7
- 8
- 9
- 10
- 11
- 12
- 13
- 14
- 15
- - OUT: # 4 bits, 16 options
  - NONE: # 0
  description: 'none'
  - HT: # 1
  description: 'Halt'
  - PO: # 2
  description: 'Program Counter Out'
  - AO: # 3
  description: 'A Register Out'
  - BO: # 4
  description: 'B Register Out'
  - MO: # 5
  description: 'Memmory Out'
  - NO: # 6
  description: 'Stack Pointer Out'
  - SO: # 7
  description: 'Stack Out'
  - HO: # 8
  description: 'HL Register Out'
  - JO: # 9
  description: 'J Scratch Register Out'
  - KO: # 10
  description: 'K Scratch Register Out'
  - DO: # 11
  description: 'D Scratch Register Out'
- - IN: # 4 bits, 16 options
  - NONE: # 0
  description: 'none'
  - PI: # 1
  description: 'Program Counter In'
  - II: # 2
  description: 'Instruction Register In'
  - XI: # 3
  description: 'ALU X Register In'
  - YI: # 4
  description: 'ALU Y Register In'
  - AI: # 5
  description: 'A Register In'
  - BI: # 6
  description: 'B Register In'
  - HI: # 7
  description: 'HL Register In'
  - MA: # 8
  description: 'Memmory Address Register In'
  - MI: # 9
  description: 'Memmory In'
  - NI: # 10
  description: 'Stack Pointer In'
  - SI: # 11
  description: 'Stack In'
  - JI: # 12
  description: 'J Scratch Register In'
  - KI: # 13
  description: 'K Scratch Register In'
  - DI: # 14
  description: 'D Scratch Register In'
- Let's Build Rocket's Inc. Modular Paylaod System Based on TMP-010 Rev
  For more information visit https://github.com/LetsBuildRockets/Modular-Payload-System
  This work is licensed under CC BY-NC 4.0. To view a copy of this license, visit https://creativecommons.org/licenses/by-nc/4.0
- Title
- Size:
- Date:
- Assembly Variant:
- B
- Number:
- Time:
- Revision:
- Sheet
- of
- Author:
- File:

### Library data of the parts
Q1 = 2N3904: NPN General Purpose Amplifier; Published: 8-Jun-2000; LatestRevisionDate: 15-Jan-2003; LatestRevisionNote: PCB Footprint 'BCY-W3/D4.7' replaced; DatasheetVersion: 1997; PackageVersion: Sep-1998; PackageReference: TO-92A; Publisher: Altium Limited; PackageDescription: TO, Flat Index; 3 In-Line, Axial Leads; Body Dia. 4.5mm; Leads 0.51 x 0.48 mm (max); ComponentLink1Description: Manufacturer Link; ComponentLink1URL: http://www.fairchildsemi.com/; ComponentLink2Description: Datasheet; ComponentLink2URL: http://www.fairchildsemi.com/ds/2N%2F2N3904.pdf
R92 R93 R123 R124 = Res1: Resistor; Published: 8-Jun-2000; LatestRevisionDate: 17-Jul-2002; LatestRevisionNote: Re-released for DXP Platform.; PackageReference: AXIAL-0.3; Publisher: Altium Limited; PackageDescription: Axial Device, Thru-Hole; 2 Leads; 0.3 in Pin Spacing
U7 = SN74LS04N: Hex Inverter; Published: 8-Jun-2000; LatestRevisionDate: 04-Mar-2005; LatestRevisionNote: Stylized 3D Model Added.; DatasheetVersion: Mar-1988; PackageVersion: Oct-1995; PackageReference: N014; Publisher: Altium Limited; PackageDescription: DIP; 14 Leads; Row Spacing 7.62 mm; Pitch 2.54 mm; ComponentLink1Description: Manufacturer Link; ComponentLink1URL: http://www.ti.com/; ComponentLink2Description: Datasheet; ComponentLink2URL: http://www-s.ti.com/sc/ds/sn74ls04.pdf
U12-U15 = SN74LS138N: 3-Line to 8-Line Decoder / Demultiplexer; Published: 8-Jun-2000; LatestRevisionDate: 04-Mar-2005; LatestRevisionNote: Stylized 3D Model Added.; DatasheetVersion: Mar-1988; PackageVersion: Oct-1995; PackageReference: N016; Publisher: Altium Limited; PackageDescription: DIP; 16 Leads; Row Spacing 7.62 mm; Pitch 2.54 mm; Code_JEDEC: MS-001-BB; ComponentLink1Description: Manufacturer Link; ComponentLink1URL: http://www.ti.com/; ComponentLink2Description: Datasheet; ComponentLink2URL: http://www-s.ti.com/sc/ds/sn74ls138.pdf

## Sheet Connector.SchDoc
size B; Author: E. Sims; Organization: Let's Build Rockets Inc.; SheetNumber: 2; SheetTotal: 6
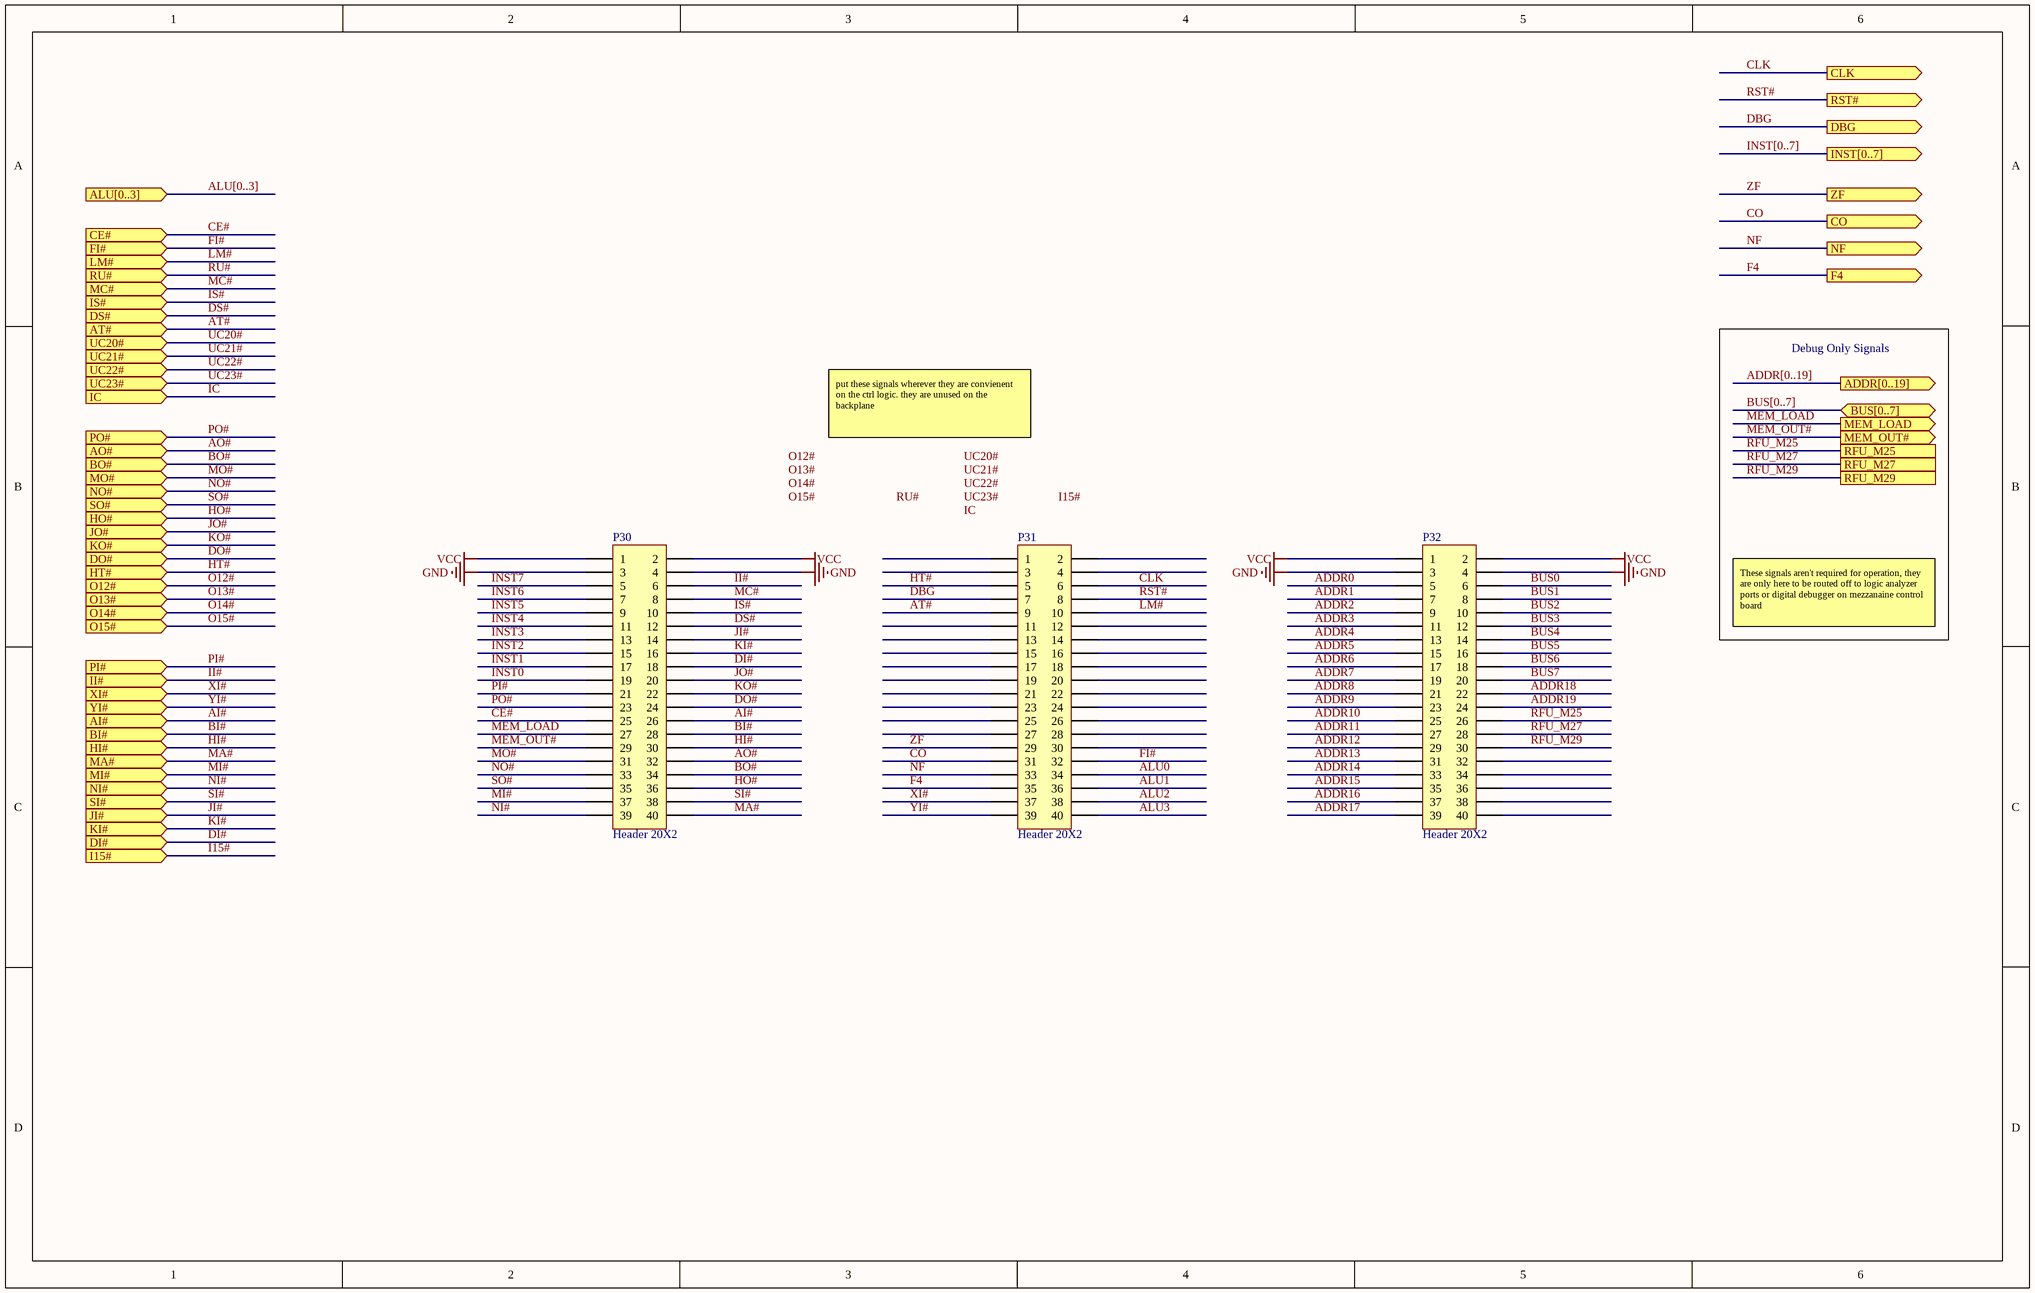
[diagram p4: Connector.SchDoc]

### Parts
P30  Header 20X2  [HDR2X20]
P31  Header 20X2  [HDR2X20]
P32  Header 20X2  [HDR2X20]

### Ports
ADDR[0..19] (out), AI# (in), ALU[0..3] (in), AO# (in), AT# (in), BI# (in), BO# (in), BUS[0..7] (bidir), CE# (in), CLK (out), CO (out), DBG (out), DI# (in), DO# (in), DS# (in), F4 (out), FI# (in), HI# (in), HO# (in), HT# (in), I15# (in), IC (in), II# (in), INST[0..7] (out), IS# (in), JI# (in), JO# (in), KI# (in), KO# (in), LM# (in), MA# (in), MC# (in), MEM_LOAD (out), MEM_OUT# (out), MI# (in), MO# (in), NF (out), NI# (in), NO# (in), O12# (in), O13# (in), O14# (in), O15# (in), PI# (in), PO# (in), RFU_M25, RFU_M27, RFU_M29, RST# (out), RU# (in), SI# (in), SO# (in), UC20# (in), UC21# (in), UC22# (in), UC23# (in), XI# (in), YI# (in), ZF (out)

### Nets
GND: P30.3 P30.4 P32.3 P32.4
VCC: P30.1 P30.2 P32.1 P32.2
ADDR0: P32.5
ADDR1: P32.7
ADDR2: P32.9
ADDR3: P32.11
ADDR4: P32.13
ADDR5: P32.15
ADDR6: P32.17
ADDR7: P32.19
ADDR8: P32.21
ADDR9: P32.23
ADDR10: P32.25
ADDR11: P32.27
ADDR12: P32.29
ADDR13: P32.31
ADDR14: P32.33
ADDR15: P32.35
ADDR16: P32.37
ADDR17: P32.39
ADDR18: P32.22
ADDR19: P32.24
AI#: P30.26 ; port AI#
ALU0: P31.34
ALU1: P31.36
ALU2: P31.38
ALU3: P31.40
AO#: P30.32 ; port AO#
AT#: P31.9 ; port AT#
BI#: P30.28 ; port BI#
BO#: P30.34 ; port BO#
BUS0: P32.6
BUS1: P32.8
BUS2: P32.10
BUS3: P32.12
BUS4: P32.14
BUS5: P32.16
BUS6: P32.18
BUS7: P32.20
CE#: P30.25 ; port CE#
CLK: P31.6 ; port CLK
CO: P31.31 ; port CO
DBG: P31.7 ; port DBG
DI#: P30.18 ; port DI#
DO#: P30.24 ; port DO#
DS#: P30.12 ; port DS#
F4: P31.35 ; port F4
FI#: P31.32 ; port FI#
HI#: P30.30 ; port HI#
HO#: P30.36 ; port HO#
HT#: P31.5 ; port HT#
II#: P30.6 ; port II#
INST0: P30.19
INST1: P30.17
INST2: P30.15
INST3: P30.13
INST4: P30.11
INST5: P30.9
INST6: P30.7
INST7: P30.5
IS#: P30.10 ; port IS#
JI#: P30.14 ; port JI#
JO#: P30.20 ; port JO#
KI#: P30.16 ; port KI#
KO#: P30.22 ; port KO#
LM#: P31.10 ; port LM#
MA#: P30.40 ; port MA#
MC#: P30.8 ; port MC#
MEM_LOAD: P30.27 ; port MEM_LOAD
MEM_OUT#: P30.29 ; port MEM_OUT#
MI#: P30.37 ; port MI#
MO#: P30.31 ; port MO#
NF: P31.33 ; port NF
NI#: P30.39 ; port NI#
NO#: P30.33 ; port NO#
PI#: P30.21 ; port PI#
PO#: P30.23 ; port PO#
RFU_M25: P32.26 ; port RFU_M25
RFU_M27: P32.28 ; port RFU_M27
RFU_M29: P32.30 ; port RFU_M29
RST#: P31.8 ; port RST#
SI#: P30.38 ; port SI#
SO#: P30.35 ; port SO#
XI#: P31.37 ; port XI#
YI#: P31.39 ; port YI#
ZF: P31.29 ; port ZF

Not connected (* = marked no-connect by the designer): P31 1 2 3 4 11 12 13 14 15 16 17 18 19 20 21 22 23 24 25 26 27 28 30; P32 32 34 36 38 40

### Buses and harness runs
bus ADDR[0..19] = port ADDR[0..19]
bus ALU[0..3] = port ALU[0..3]
bus BUS[0..7] = port BUS[0..7]
bus INST[0..7] = port INST[0..7]

### Notes on the sheet
- Debug Only Signals
- put these signals wherever they are convienent on the ctrl logic. they are unused on the backplane
- These signals aren't required for operation, they are only here to be routed off to logic analyzer ports or digital debugger on mezzanaine control board
- Labels drawn without touching a wire or pin: I15#, IC, O12#, O13#, O14#, O15#, RU#, UC20#, UC21#, UC22#, UC23#
- Let's Build Rocket's Inc. Modular Paylaod System Based on TMP-010 Rev
  For more information visit https://github.com/LetsBuildRockets/Modular-Payload-System
  This work is licensed under CC BY-NC 4.0. To view a copy of this license, visit https://creativecommons.org/licenses/by-nc/4.0
- Title
- Size:
- Date:
- Assembly Variant:
- B
- Number:
- Time:
- Revision:
- Sheet
- of
- Author:
- File:

### Library data of the parts
P30-P32 = Header 20X2: Header, 20-Pin, Dual row; System: Connector; LatestRevisionDate: 17-Jul-2002; LatestRevisionNote: Re-released for DXP Platform.; Publisher: Altium Limited

## Sheet Debugger.SchDoc
size B; Author: E. Sims; Organization: Let's Build Rockets Inc.; SheetNumber: 6; SheetTotal: 6
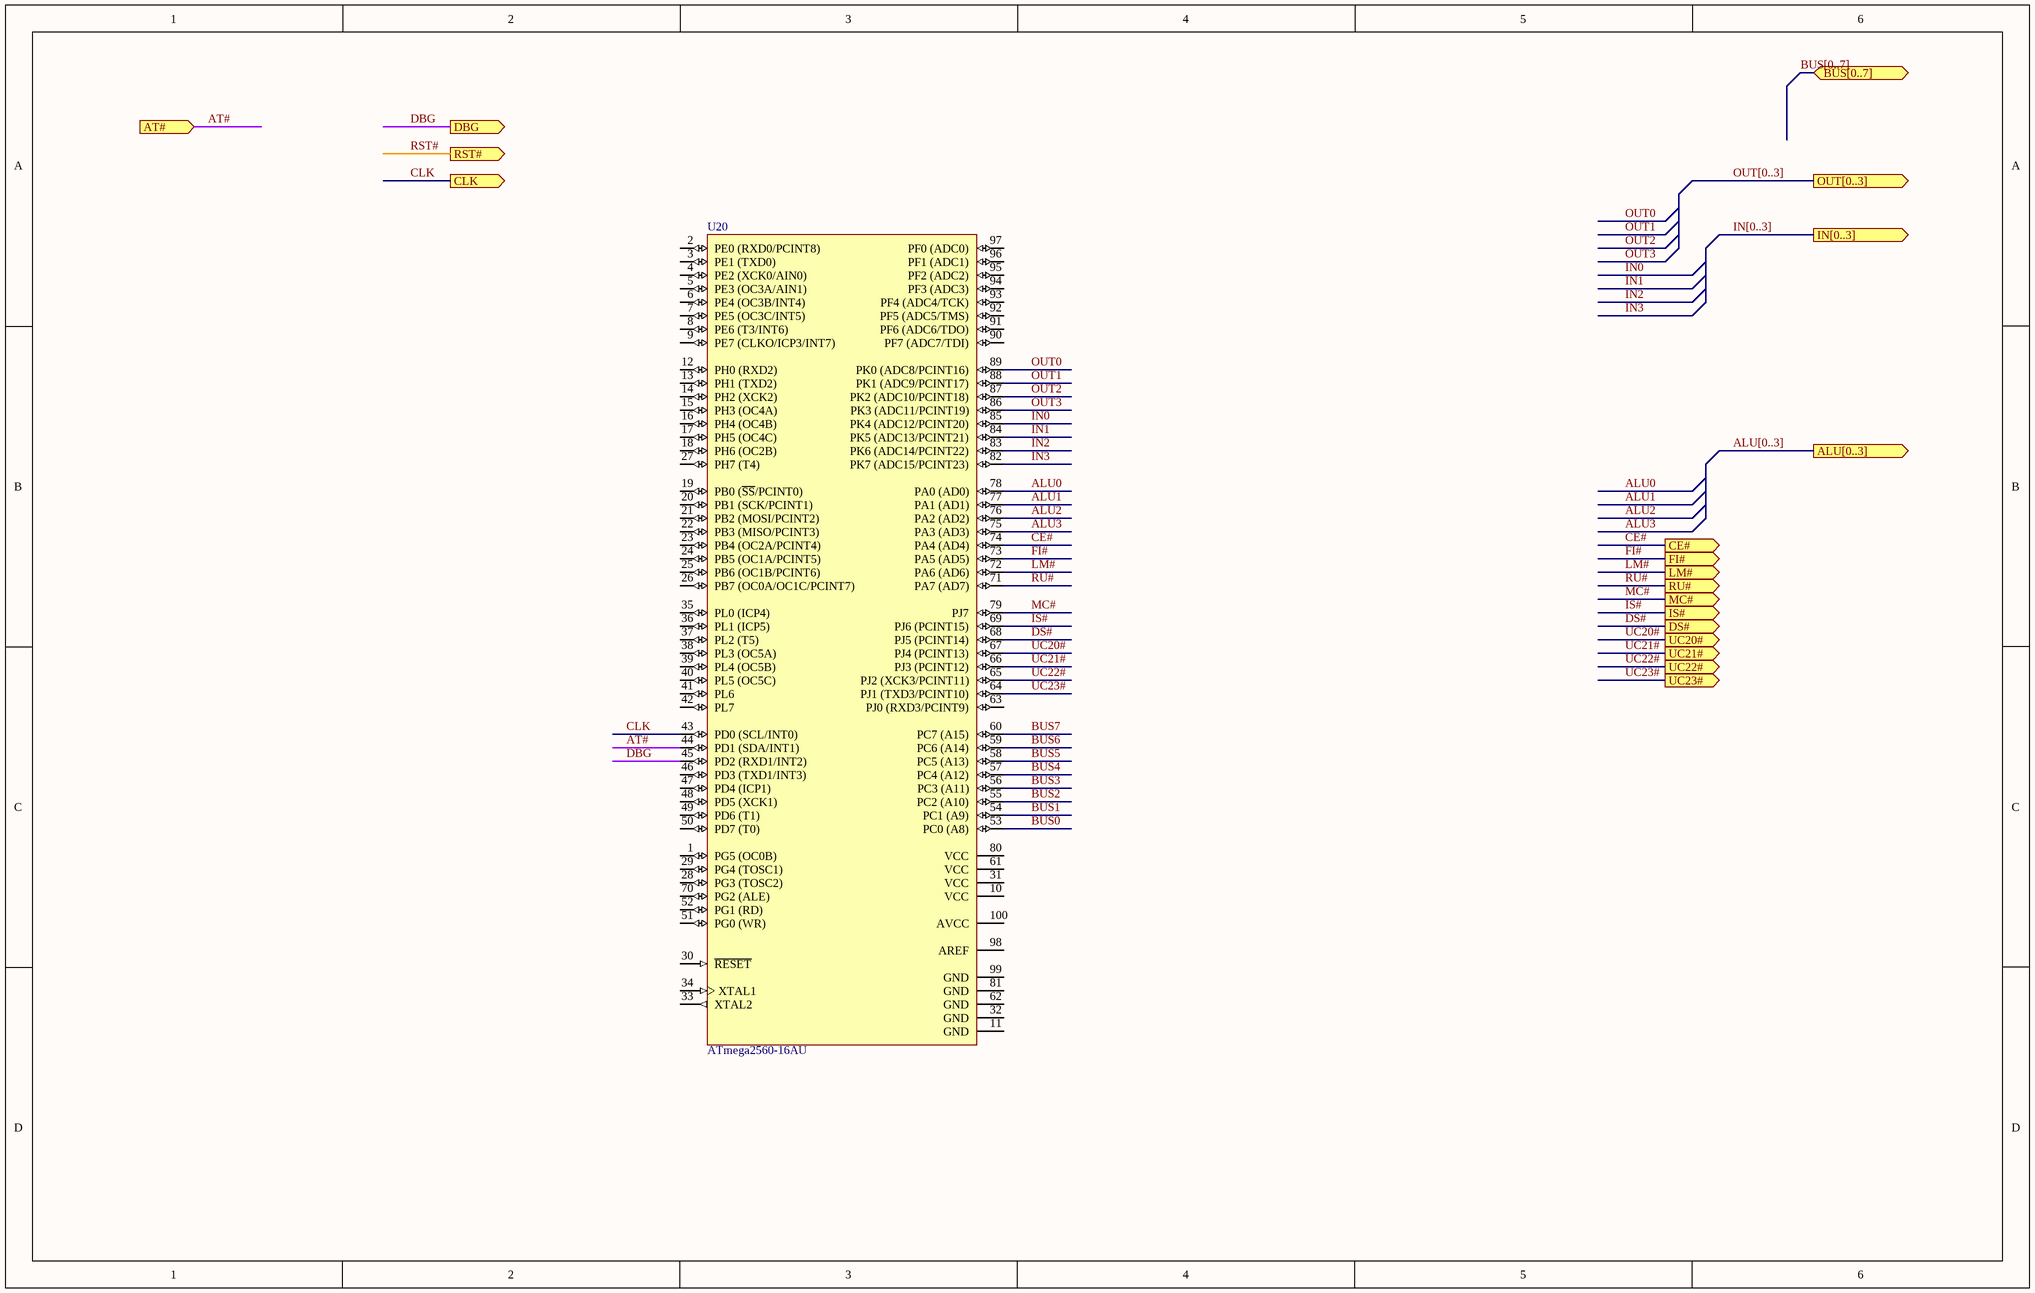
[diagram p5: Debugger.SchDoc]

### Parts
U20  ATmega2560-16AU  [100A_M]

### Ports
ALU[0..3] (out), AT# (in), BUS[0..7] (bidir), CE# (out), CLK (out), DBG (out), DS# (out), FI# (out), IN[0..3] (out), IS# (out), LM# (out), MC# (out), OUT[0..3] (out), RST# (out), RU# (out), UC20# (out), UC21# (out), UC22# (out), UC23# (out)

### Nets
ALU0: U20.78(PA0_(AD0))
ALU1: U20.77(PA1_(AD1))
ALU2: U20.76(PA2_(AD2))
ALU3: U20.75(PA3_(AD3))
AT#: U20.44(PD1_(SDA/INT1)) ; port AT#
BUS0: U20.53(PC0_(A8))
BUS1: U20.54(PC1_(A9))
BUS2: U20.55(PC2_(A10))
BUS3: U20.56(PC3_(A11))
BUS4: U20.57(PC4_(A12))
BUS5: U20.58(PC5_(A13))
BUS6: U20.59(PC6_(A14))
BUS7: U20.60(PC7_(A15))
CE#: U20.74(PA4_(AD4)) ; port CE#
CLK: U20.43(PD0_(SCL/INT0)) ; port CLK
DBG: U20.45(PD2_(RXD1/INT2)) ; port DBG
DS#: U20.68(PJ5_(PCINT14)) ; port DS#
FI#: U20.73(PA5_(AD5)) ; port FI#
IN0: U20.85(PK4_(ADC12/PCINT20))
IN1: U20.84(PK5_(ADC13/PCINT21))
IN2: U20.83(PK6_(ADC14/PCINT22))
IN3: U20.82(PK7_(ADC15/PCINT23))
IS#: U20.69(PJ6_(PCINT15)) ; port IS#
LM#: U20.72(PA6_(AD6)) ; port LM#
MC#: U20.79(PJ7) ; port MC#
OUT0: U20.89(PK0_(ADC8/PCINT16))
OUT1: U20.88(PK1_(ADC9/PCINT17))
OUT2: U20.87(PK2_(ADC10/PCINT18))
OUT3: U20.86(PK3_(ADC11/PCINT19))
RST#: port RST#
RU#: U20.71(PA7_(AD7)) ; port RU#
UC20#: U20.67(PJ4_(PCINT13)) ; port UC20#
UC21#: U20.66(PJ3_(PCINT12)) ; port UC21#
UC22#: U20.65(PJ2_(XCK3/PCINT11)) ; port UC22#
UC23#: U20.64(PJ1_(TXD3/PCINT10)) ; port UC23#

Not connected (* = marked no-connect by the designer): U20 1(PG5_(OC0B)) 2(PE0_(RXD0/PCINT8)) 3(PE1_(TXD0)) 4(PE2_(XCK0/AIN0)) 5(PE3_(OC3A/AIN1)) 6(PE4_(OC3B/INT4)) 7(PE5_(OC3C/INT5)) 8(PE6_(T3/INT6)) 9(PE7_(CLKO/ICP3/INT7)) 10(VCC) 11(GND) 12(PH0_(RXD2)) 13(PH1_(TXD2)) 14(PH2_(XCK2)) 15(PH3_(OC4A)) 16(PH4_(OC4B)) 17(PH5_(OC4C)) 18(PH6_(OC2B)) 19(PB0_(~{SS}/PCINT0)) 20(PB1_(SCK/PCINT1)) 21(PB2_(MOSI/PCINT2)) 22(PB3_(MISO/PCINT3)) 23(PB4_(OC2A/PCINT4)) 24(PB5_(OC1A/PCINT5)) 25(PB6_(OC1B/PCINT6)) 26(PB7_(OC0A/OC1C/PCINT7)) 27(PH7_(T4)) 28(PG3_(TOSC2)) 29(PG4_(TOSC1)) 30(~{RESET}) 31(VCC) 32(GND) 33(XTAL2) 34(XTAL1) 35(PL0_(ICP4)) 36(PL1_(ICP5)) 37(PL2_(T5)) 38(PL3_(OC5A)) 39(PL4_(OC5B)) 40(PL5_(OC5C)) 41(PL6) 42(PL7) 46(PD3_(TXD1/INT3)) 47(PD4_(ICP1)) 48(PD5_(XCK1)) 49(PD6_(T1)) 50(PD7_(T0)) 51(PG0_(WR)) 52(PG1_(RD)) 61(VCC) 62(GND) 63(PJ0_(RXD3/PCINT9)) 70(PG2_(ALE)) 80(VCC) 81(GND) 90(PF7_(ADC7/TDI)) 91(PF6_(ADC6/TDO)) 92(PF5_(ADC5/TMS)) 93(PF4_(ADC4/TCK)) 94(PF3_(ADC3)) 95(PF2_(ADC2)) 96(PF1_(ADC1)) 97(PF0_(ADC0)) 98(AREF) 99(GND) 100(AVCC)

### Buses and harness runs
bus ALU[0..3] = port ALU[0..3]
bus BUS[0..7] = port BUS[0..7]
bus IN[0..3] = port IN[0..3]
bus OUT[0..3] = port OUT[0..3]

### Notes on the sheet
- Let's Build Rocket's Inc. Modular Paylaod System Based on TMP-010 Rev
  For more information visit https://github.com/LetsBuildRockets/Modular-Payload-System
  This work is licensed under CC BY-NC 4.0. To view a copy of this license, visit https://creativecommons.org/licenses/by-nc/4.0
- Title
- Size:
- Date:
- Assembly Variant:
- B
- Number:
- Time:
- Revision:
- Sheet
- of
- Author:
- File:

### Library data of the parts
U20 = CMP-0095-00210-2: 8-bit AVR Microcontroller, 4.5-5.5V, 16MHz, 256KB Flash, 4KB EEPROM, 8KB SRAM, 86 GPIO pins, 100-pin TQFP, Industrial Grade (-40°C to 85°C), Pb-Free; PackageDescription: 100-Pin Thin Profile Plastic Quad Flat Pack (TQFP), 14 x 14 x 1.0 mm Body, 0.5 mm Pitch; ComponentLink1Description: Manufacturer URL; ComponentLink3URL: http://www.atmel.com/dyn/resources/prod_documents/2549S.pdf; RevisionNote: DatasheetVersion & PackageVersion updated. URLs added.; DatasheetVersion: revN, May-2011; ComponentLink2Description: ATmega640/1280/1281/2560/2561 Datasheet; PackageReference: 100A; PackageVersion: revD, Oct-2010; Code_JEDEC: MS-026-AED; ComponentLink1URL: http://www.atmel.com/; ComponentLink2URL: http://www.atmel.com/dyn/resources/prod_documents/doc2549.pdf; ComponentLink3Description: ATmega640/1280/1281/2560/2561 Summary

## Nets that join several sheets
GND: Top (6 pins), Microcode (31 pins), G1 (18 pins), Decode (13 pins), G2 (18 pins), Connector (P30.3 P30.4 P32.3 P32.4), G3 (18 pins)
VCC: Top (TP14.1), Microcode (23 pins), Decode (8 pins), Connector (P30.1 P30.2 P32.1 P32.2)
ADDR0: Top (R91.1), Connector (P32.5)
ADDR1: Top (R94.1), Connector (P32.7)
ADDR2: Top (R95.1), Connector (P32.9)
ADDR3: Top (R96.1), Connector (P32.11)
ADDR4: Top (R97.1), Connector (P32.13)
ADDR5: Top (R98.1), Connector (P32.15)
ADDR6: Top (R99.1), Connector (P32.17)
ADDR7: Top (R100.1), Connector (P32.19)
ADDR8: Top (R101.1), Connector (P32.21)
ADDR9: Top (R102.1), Connector (P32.23)
ADDR10: Top (R103.1), Connector (P32.25)
ADDR11: Top (R104.1), Connector (P32.27)
ADDR12: Top (R105.1), Connector (P32.29)
ADDR13: Top (R106.1), Connector (P32.31)
ADDR14: Top (R107.1), Connector (P32.33)
ADDR15: Top (R108.1), Connector (P32.35)
AI#: Decode (U14.10), Connector (P30.26)
ALU0: Top (R59.1), Microcode (R68.2 U2.13), Connector (P31.34)
ALU1: Top (R60.1), Microcode (R70.2 U2.14), Connector (P31.36)
ALU2: Top (R61.1), Microcode (R72.2 U2.15), Connector (P31.38)
ALU3: Top (R62.1), Microcode (R74.2 U2.17), Connector (P31.40)
AO#: Decode (U12.12), Connector (P30.32)
AT#: Top (TP6.1), Microcode (R86.1 U3.17), Connector (P31.9)
BI#: Decode (U14.9), Connector (P30.28)
BO#: Decode (U12.11), Connector (P30.34)
CE#: Microcode (R79.1 U2.18), Connector (P30.25)
CLK: Top (TP2.1), Microcode (U5.5), G1 (R49_G1.1), G2 (R49_G2.1), Connector (P31.6), G3 (R49_G3.1)
CO: Top (R63.1), Microcode (U1.29 U2.29 U3.29), Connector (P31.31)
DBG: Top (TP7.1), Microcode (U5.1)
DI#: Decode (U15.9), Connector (P30.18)
DO#: Decode (U13.12), Connector (P30.24)
DS#: Microcode (R84.1 U3.15), Connector (P30.12)
FI#: Microcode (R81.1 U2.19), Connector (P31.32)
HI#: Decode (U14.7), Connector (P30.30)
HO#: Decode (U13.15), Connector (P30.36)
HT#: Top (TP5.1), Decode (R124.1), Connector (P31.5)
IC: Top (TP15.1), Microcode (U9.6)
II#: Decode (U14.13), Connector (P30.6)
IN0: Top (R51.1), Microcode (R75.2 U1.18), Decode (U14.1 U15.1)
IN1: Top (R52.1), Microcode (R76.2 U1.19), Decode (U14.2 U15.2)
IN2: Top (R53.1), Microcode (R77.2 U1.20), Decode (U14.3 U15.3)
IN3: Top (R54.1), Microcode (R78.2 U1.21)
INST0: Top (R33.1), Microcode (U1.6 U2.6 U3.6), Connector (P30.19)
INST1: Top (R34.1), Microcode (U1.5 U2.5 U3.5), Connector (P30.17)
INST2: Top (R35.1), Microcode (U1.27 U2.27 U3.27), Connector (P30.15)
INST3: Top (R36.1), Microcode (U1.26 U2.26 U3.26), Connector (P30.13)
INST4: Top (R37.1), Microcode (U1.23 U2.23 U3.23), Connector (P30.11)
INST5: Top (R38.1), Microcode (U1.25 U2.25 U3.25), Connector (P30.9)
INST6: Top (R39.1), Microcode (U1.4 U2.4 U3.4), Connector (P30.7)
INST7: Top (R40.1), Microcode (U1.28 U2.28 U3.28), Connector (P30.5)
IS#: Microcode (R82.1 U3.14), Connector (P30.10)
JI#: Decode (U15.11), Connector (P30.14)
JO#: Decode (U13.14), Connector (P30.20)
KI#: Decode (U15.10), Connector (P30.16)
KO#: Decode (U13.13), Connector (P30.22)
LM#: Top (TP3.1), Microcode (R83.1 U2.20), Connector (P31.10)
LOGIC.D0: Top (R33.2), G1 (R1_G1.1)
LOGIC.D0: Top (R51.2), G2 (R1_G2.1)
LOGIC.D0: Top (R91.2), G3 (R1_G3.1)
LOGIC.D1: Top (R34.2), G1 (R2_G1.1)
LOGIC.D1: Top (R52.2), G2 (R2_G2.1)
LOGIC.D1: Top (R94.2), G3 (R2_G3.1)
LOGIC.D2: Top (R35.2), G1 (R3_G1.1)
LOGIC.D2: Top (R53.2), G2 (R3_G2.1)
LOGIC.D2: Top (R95.2), G3 (R3_G3.1)
LOGIC.D3: Top (R36.2), G1 (R4_G1.1)
LOGIC.D3: Top (R54.2), G2 (R4_G2.1)
LOGIC.D3: Top (R96.2), G3 (R4_G3.1)
LOGIC.D4: Top (R37.2), G1 (R5_G1.1)
LOGIC.D4: Top (R55.2), G2 (R5_G2.1)
LOGIC.D4: Top (R97.2), G3 (R5_G3.1)
LOGIC.D5: Top (R38.2), G1 (R6_G1.1)
LOGIC.D5: Top (R56.2), G2 (R6_G2.1)
LOGIC.D5: Top (R98.2), G3 (R6_G3.1)
LOGIC.D6: Top (R39.2), G1 (R7_G1.1)
LOGIC.D6: Top (R57.2), G2 (R7_G2.1)
LOGIC.D6: Top (R99.2), G3 (R7_G3.1)
LOGIC.D7: Top (R40.2), G1 (R8_G1.1)
LOGIC.D7: Top (R58.2), G2 (R8_G2.1)
LOGIC.D7: Top (R100.2), G3 (R8_G3.1)
LOGIC.D8: Top (R41.2), G1 (R17_G1.1)
LOGIC.D8: Top (R59.2), G2 (R17_G2.1)
LOGIC.D8: Top (R101.2), G3 (R17_G3.1)
LOGIC.D9: Top (R42.2), G1 (R18_G1.1)
LOGIC.D9: Top (R60.2), G2 (R18_G2.1)
LOGIC.D9: Top (R102.2), G3 (R18_G3.1)
LOGIC.D10: Top (R43.2), G1 (R19_G1.1)
LOGIC.D10: Top (R61.2), G2 (R19_G2.1)
LOGIC.D10: Top (R103.2), G3 (R19_G3.1)
LOGIC.D11: Top (R44.2), G1 (R20_G1.1)
LOGIC.D11: Top (R62.2), G2 (R20_G2.1)
LOGIC.D11: Top (R104.2), G3 (R20_G3.1)
LOGIC.D12: Top (R45.2), G1 (R21_G1.1)
LOGIC.D12: Top (R63.2), G2 (R21_G2.1)
LOGIC.D12: Top (R105.2), G3 (R21_G3.1)
LOGIC.D13: Top (R46.2), G1 (R22_G1.1)
LOGIC.D13: Top (R64.2), G2 (R22_G2.1)
LOGIC.D13: Top (R106.2), G3 (R22_G3.1)
LOGIC.D14: Top (R47.2), G1 (R23_G1.1)
LOGIC.D14: Top (R65.2), G2 (R23_G2.1)
LOGIC.D14: Top (R107.2), G3 (R23_G3.1)
LOGIC.D15: Top (R48.2), G1 (R24_G1.1)
LOGIC.D15: Top (R66.2), G2 (R24_G2.1)
LOGIC.D15: Top (R108.2), G3 (R24_G3.1)
MA#: Decode (U15.15), Connector (P30.40)
MC#: Microcode (R80.1 U3.13), Connector (P30.8)
MI#: Decode (U15.14), Connector (P30.37)
MO#: Decode (U12.10), Connector (P30.31)
NF: Top (R65.1), Microcode (U1.2 U2.2 U3.2), Connector (P31.33)
NI#: Decode (U15.13), Connector (P30.39)
NO#: Decode (U12.9), Connector (P30.33)
OUT0: Top (R55.1), Microcode (R67.2 U1.13), Decode (U12.1 U13.1)
OUT1: Top (R56.1), Microcode (R69.2 U1.14), Decode (U12.2 U13.2)
OUT2: Top (R57.1), Microcode (R71.2 U1.15), Decode (U12.3 U13.3)
OUT3: Top (R58.1), Microcode (R73.2 U1.17), Decode (U12.4 U13.6 U14.4 U15.6)
PI#: Decode (U14.14), Connector (P30.21)
PO#: Decode (U12.13), Connector (P30.23)
RST#: Top (R66.1 TP4.1), Microcode (U4.1 U6.1 U9.9), Connector (P31.8)
RU#: Top (TP1.1), Microcode (R85.1 U2.21 U4.9 U6.9)
SI#: Decode (U15.12), Connector (P30.38)
SO#: Decode (U12.7), Connector (P30.35)
UC0: Top (R41.1), Microcode (5 pins)
UC1: Top (R42.1), Microcode (5 pins)
UC2: Top (R43.1), Microcode (5 pins)
UC3: Top (R44.1), Microcode (5 pins)
UC4: Top (R45.1), Microcode (5 pins)
UC5: Top (R46.1), Microcode (5 pins)
XI#: Decode (U14.12), Connector (P31.37)
YI#: Decode (U14.11), Connector (P31.39)
ZF: Top (R64.1), Microcode (U1.3 U2.3 U3.3), Connector (P31.29)